# Altium project q23-harness.PrjPcb (part 1 of 2)
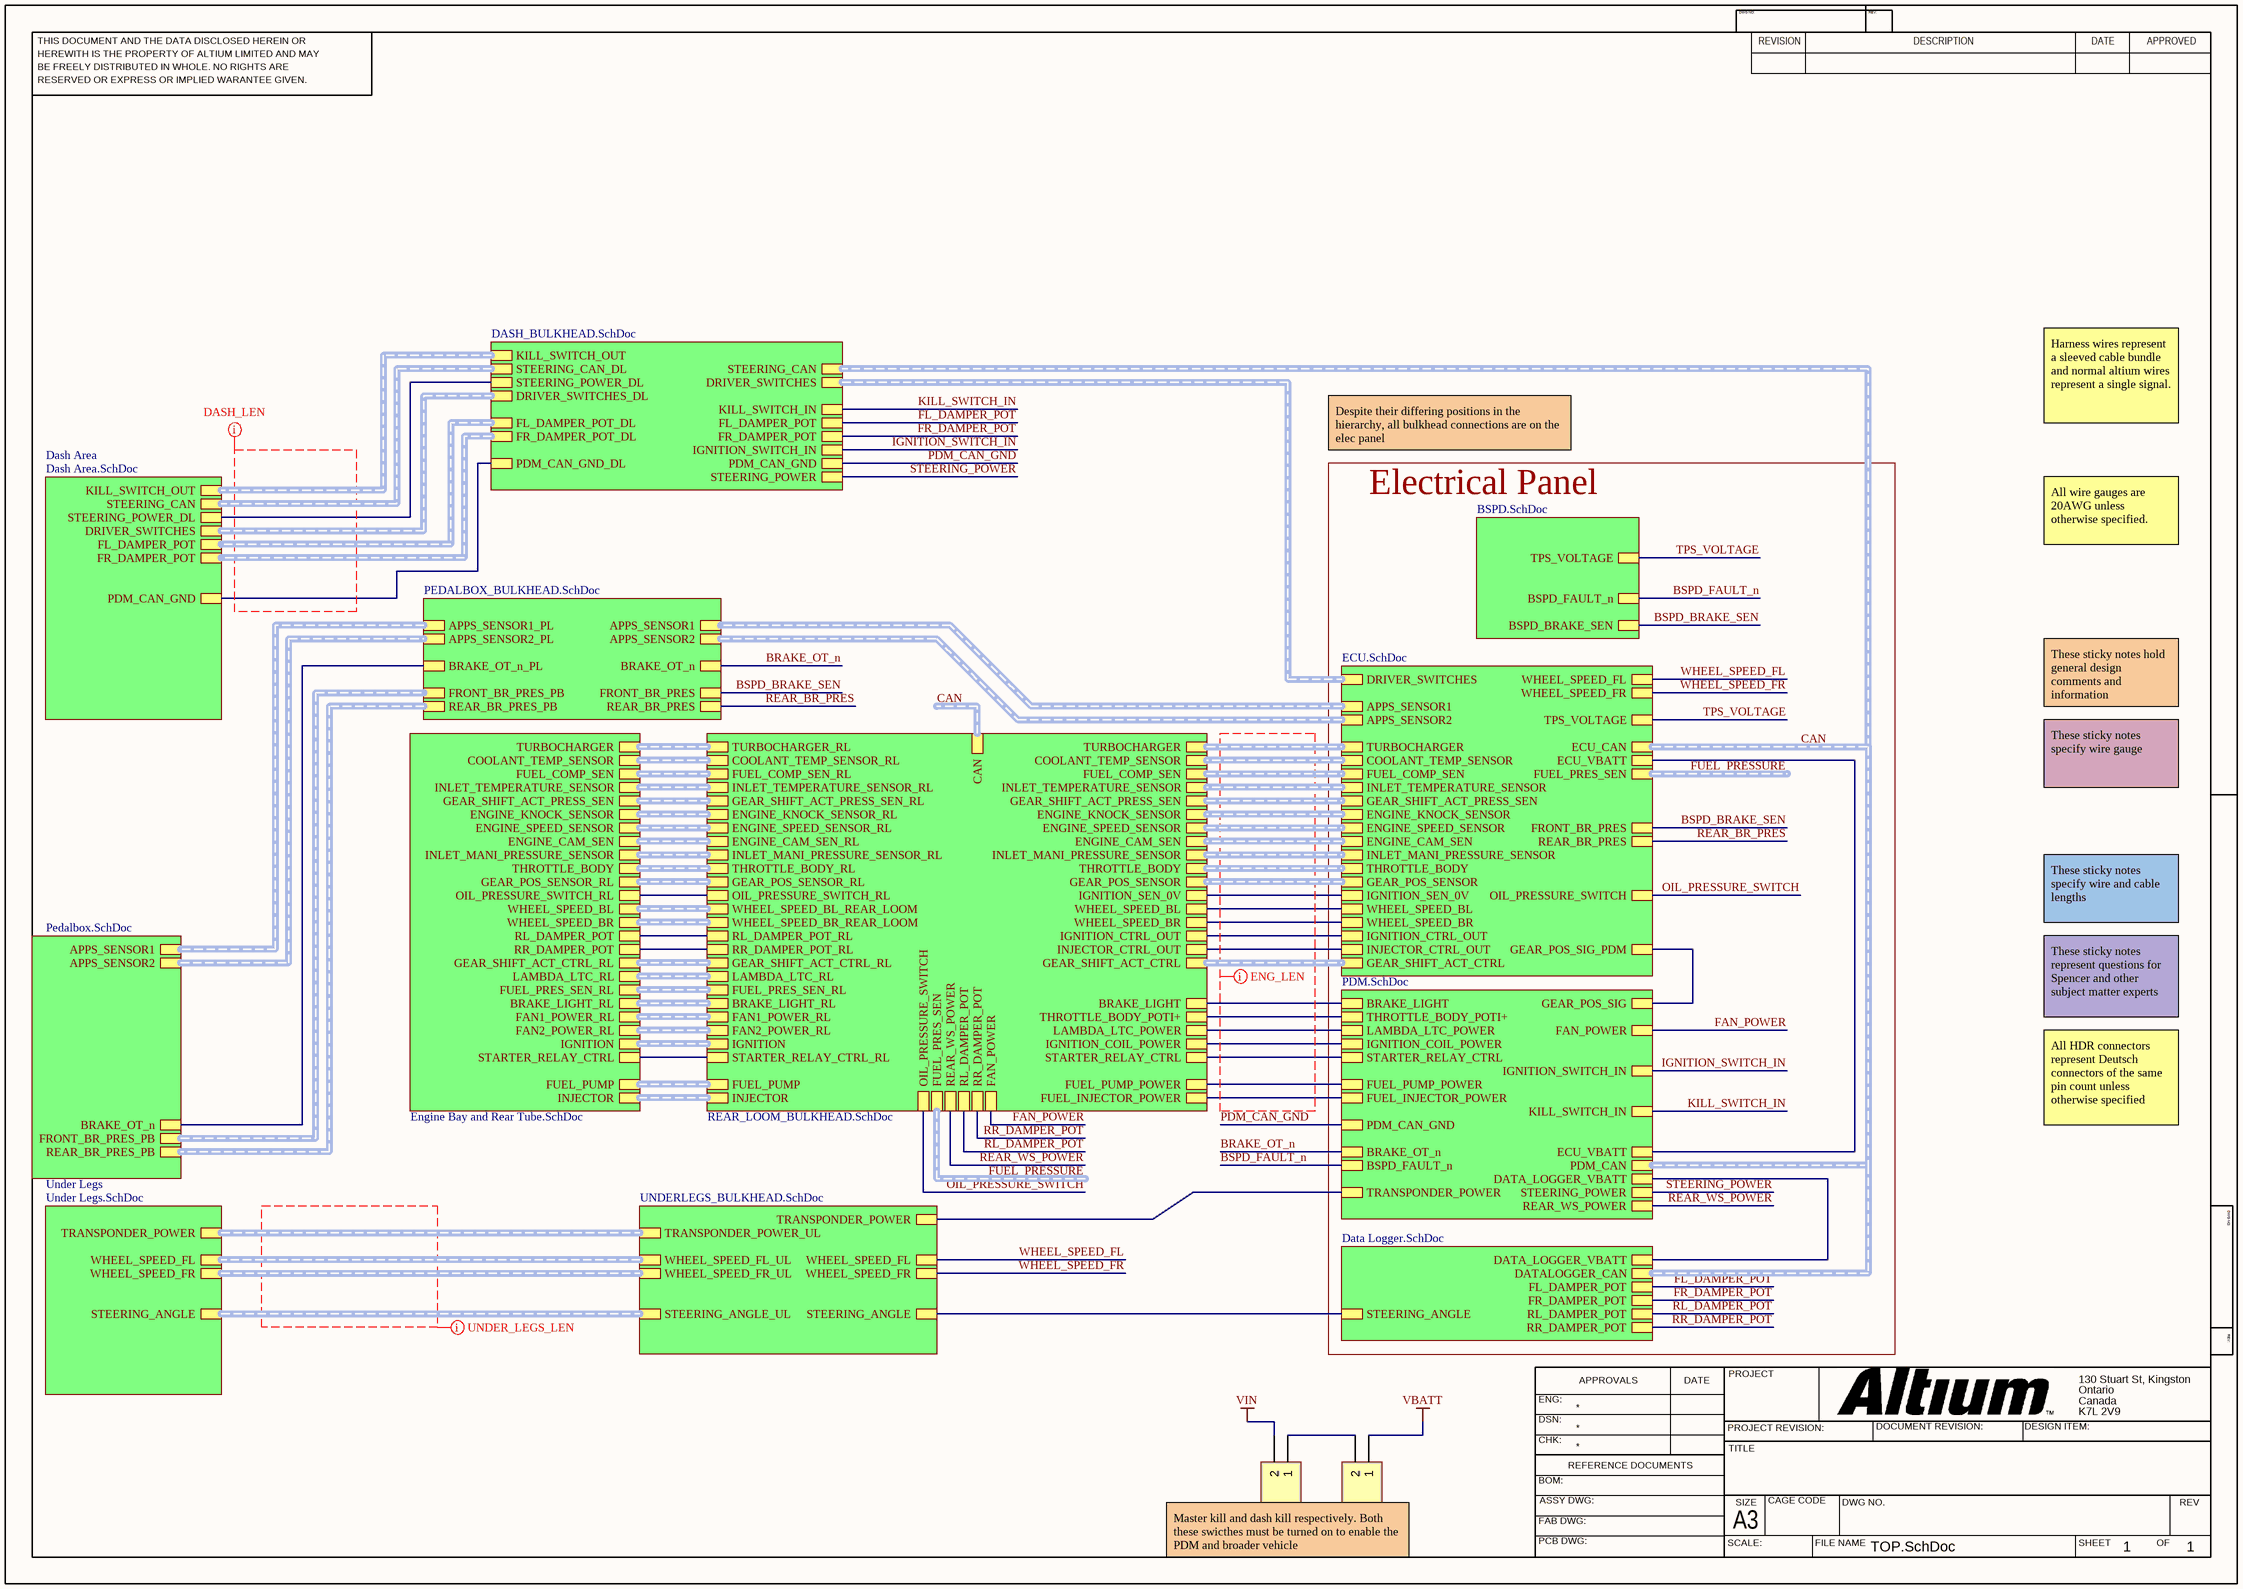
[diagram p0: TOP.SchDoc]
14 sheets, 69 parts. Net scope: hierarchical (ports join the sheet entries above them; power ports are global).
Sheets:
  TOP.SchDoc
    Dash Area = Dash Area.SchDoc
    Pedalbox = Pedalbox.SchDoc
    Under Legs = Under Legs.SchDoc
    ECU = ECU.SchDoc
    Engine Bay and Rear Tube = Engine Bay and Rear Tube.SchDoc
    PDM = PDM.SchDoc
    Data Logger = Data Logger.SchDoc
    Engine Bay and Rear Tube = REAR_LOOM_BULKHEAD.SchDoc
    PEDALBOX_BULKHEAD = PEDALBOX_BULKHEAD.SchDoc
    UNDERLEGS_BULKHEAD = UNDERLEGS_BULKHEAD.SchDoc
    DASH_BULKHEAD = DASH_BULKHEAD.SchDoc
    BSPD = BSPD.SchDoc
  LEGEND.SchDoc

## Sheet TOP.SchDoc: =DocumentName
size 420 x 297 mm; Organization: Queen's Formula SAE; Address1: 130 Stuart St, Kingston; Address2: Ontario; Address3: Canada; Address4: K7L 2V9; DocumentNumber: 1; Revision: 0; SheetNumber: 1; SheetTotal: 1

### Parts
(Parts that share a designator on the sheet are numbered #1, #2 ... from top to bottom, then left to right.)
ECU_CAN_CONNECTOR?#1  Header 2  [HDR1X2]  (value not drawn)
ECU_CAN_CONNECTOR?#2  Header 2  [HDR1X2]  (value not drawn)

### Sub-sheets
BSPD = BSPD.SchDoc: TPS_VOLTAGE, BSPD_BRAKE_SEN, BSPD_FAULT_n
Dash Area = Dash Area.SchDoc: STEERING_CAN (harness CAN), DRIVER_SWITCHES (harness DRIVER_SWITCHES), FL_DAMPER_POT, FR_DAMPER_POT, PDM_CAN_GND, STEERING_POWER_DL, KILL_SWITCH_OUT
DASH_BULKHEAD = DASH_BULKHEAD.SchDoc: DRIVER_SWITCHES (harness DRIVER_SWITCHES), STEERING_CAN (harness CAN), FL_DAMPER_POT, FR_DAMPER_POT, PDM_CAN_GND, DRIVER_SWITCHES_DL (harness DRIVER_SWITCHES), STEERING_CAN_DL (harness CAN), FL_DAMPER_POT_DL, FR_DAMPER_POT_DL, PDM_CAN_GND_DL, STEERING_POWER, STEERING_POWER_DL, KILL_SWITCH_IN, KILL_SWITCH_OUT, IGNITION_SWITCH_IN
Data Logger = Data Logger.SchDoc: DATALOGGER_CAN (harness CAN), DATA_LOGGER_VBATT, STEERING_ANGLE, RL_DAMPER_POT, RR_DAMPER_POT, FL_DAMPER_POT, FR_DAMPER_POT
ECU = ECU.SchDoc: ECU_CAN (harness CAN), ECU_VBATT, DRIVER_SWITCHES (harness DRIVER_SWITCHES), APPS_SENSOR1 (harness 3WIRE_PSG_SENSOR), COOLANT_TEMP_SENSOR (harness 2WIRE_SENSOR), INLET_TEMPERATURE_SENSOR (harness 2WIRE_SENSOR), FUEL_COMP_SEN (harness 2WIRE_SENSOR), GEAR_SHIFT_ACT_PRESS_SEN (harness 2WIRE_SENSOR), ENGINE_KNOCK_SENSOR (harness 2WIRE_ACTUATOR), ENGINE_SPEED_SENSOR (harness 2WIRE_ACTUATOR), WHEEL_SPEED_BL, WHEEL_SPEED_BR, WHEEL_SPEED_FL, WHEEL_SPEED_FR, ENGINE_CAM_SEN (harness 2WIRE_ACTUATOR), INLET_MANI_PRESSURE_SENSOR (harness 2WIRE_ACTUATOR), THROTTLE_BODY (harness 2WIRE_ACTUATOR), GEAR_SHIFT_ACT_CTRL (harness GEAR_SHIFT_ACTUATOR), TURBOCHARGER (harness TURBO), APPS_SENSOR2 (harness 3WIRE_PSG_SENSOR), IGNITION_CTRL_OUT, INJECTOR_CTRL_OUT, TPS_VOLTAGE, GEAR_POS_SENSOR (harness 2WIRE_ACTUATOR), IGNITION_SEN_0V, FUEL_PRES_SEN (harness 3WIRE_PSG_SENSOR), OIL_PRESSURE_SWITCH, FRONT_BR_PRES, REAR_BR_PRES, GEAR_POS_SIG_PDM
Engine Bay and Rear Tube = Engine Bay and Rear Tube.SchDoc: COOLANT_TEMP_SENSOR (harness 2WIRE_SENSOR), INLET_TEMPERATURE_SENSOR (harness 2WIRE_SENSOR), FUEL_COMP_SEN (harness 3WIRE_PSG_SENSOR), GEAR_SHIFT_ACT_PRESS_SEN (harness 3WIRE_PSG_SENSOR), ENGINE_KNOCK_SENSOR (harness 2WIRE_ACTUATOR), ENGINE_SPEED_SENSOR, ENGINE_CAM_SEN, INLET_MANI_PRESSURE_SENSOR, THROTTLE_BODY, WHEEL_SPEED_BL, WHEEL_SPEED_BR, GEAR_SHIFT_ACT_CTRL_RL, BRAKE_LIGHT_RL, IGNITION, STARTER_RELAY_CTRL, FUEL_PUMP, INJECTOR, TURBOCHARGER, RL_DAMPER_POT, RR_DAMPER_POT, GEAR_POS_SENSOR_RL, FAN1_POWER_RL, FAN2_POWER_RL, FUEL_PRES_SEN_RL, LAMBDA_LTC_RL, OIL_PRESSURE_SWITCH_RL
Engine Bay and Rear Tube = REAR_LOOM_BULKHEAD.SchDoc: BRAKE_LIGHT, WHEEL_SPEED_BL, WHEEL_SPEED_BR, THROTTLE_BODY_POTI+, IGNITION_COIL_POWER, STARTER_RELAY_CTRL, FUEL_PUMP_POWER, FUEL_INJECTOR_POWER, GEAR_SHIFT_ACT_CTRL, COOLANT_TEMP_SENSOR_RL (harness 2WIRE_SENSOR), INLET_TEMPERATURE_SENSOR_RL (harness 2WIRE_SENSOR), FUEL_COMP_SEN_RL (harness 3WIRE_PSG_SENSOR), GEAR_SHIFT_ACT_PRESS_SEN_RL (harness 3WIRE_PSG_SENSOR), ENGINE_KNOCK_SENSOR_RL (harness 2WIRE_ACTUATOR), ENGINE_SPEED_SENSOR_RL, ENGINE_CAM_SEN_RL, INLET_MANI_PRESSURE_SENSOR_RL, THROTTLE_BODY_RL, TURBOCHARGER_RL, COOLANT_TEMP_SENSOR (harness 2WIRE_SENSOR), INLET_TEMPERATURE_SENSOR (harness 2WIRE_SENSOR), FUEL_COMP_SEN (harness 3WIRE_PSG_SENSOR), GEAR_SHIFT_ACT_PRESS_SEN (harness 3WIRE_PSG_SENSOR), ENGINE_KNOCK_SENSOR (harness 2WIRE_ACTUATOR), ENGINE_SPEED_SENSOR, ENGINE_CAM_SEN, INLET_MANI_PRESSURE_SENSOR, THROTTLE_BODY, TURBOCHARGER, WHEEL_SPEED_BL_REAR_LOOM, WHEEL_SPEED_BR_REAR_LOOM, GEAR_SHIFT_ACT_CTRL_RL, BRAKE_LIGHT_RL, IGNITION_CTRL_OUT, INJECTOR_CTRL_OUT, IGNITION, INJECTOR, FUEL_PUMP, STARTER_RELAY_CTRL_RL, GEAR_POS_SENSOR, RL_DAMPER_POT_RL, RR_DAMPER_POT_RL, GEAR_POS_SENSOR_RL, RL_DAMPER_POT, RR_DAMPER_POT, REAR_WS_POWER, IGNITION_SEN_0V, FAN_POWER, FAN2_POWER_RL, FAN1_POWER_RL, FUEL_PRES_SEN_RL, FUEL_PRES_SEN, CAN, LAMBDA_LTC_POWER, LAMBDA_LTC_RL, OIL_PRESSURE_SWITCH, OIL_PRESSURE_SWITCH_RL
PDM = PDM.SchDoc: TRANSPONDER_POWER, BRAKE_LIGHT, BRAKE_OT_n, BSPD_FAULT_n, PDM_CAN_GND, PDM_CAN (harness CAN), DATA_LOGGER_VBATT, ECU_VBATT, KILL_SWITCH_IN, THROTTLE_BODY_POTI+, IGNITION_COIL_POWER, STARTER_RELAY_CTRL, FUEL_PUMP_POWER, FUEL_INJECTOR_POWER, FAN_POWER, STEERING_POWER, REAR_WS_POWER, LAMBDA_LTC_POWER, IGNITION_SWITCH_IN, GEAR_POS_SIG
Pedalbox = Pedalbox.SchDoc: APPS_SENSOR1 (harness 3WIRE_PSG_SENSOR), BRAKE_OT_n, APPS_SENSOR2, FRONT_BR_PRES_PB, REAR_BR_PRES_PB
PEDALBOX_BULKHEAD = PEDALBOX_BULKHEAD.SchDoc: APPS_SENSOR1 (harness 3WIRE_PSG_SENSOR), APPS_SENSOR2, BRAKE_OT_n, APPS_SENSOR1_PL (harness 3WIRE_PSG_SENSOR), APPS_SENSOR2_PL, BRAKE_OT_n_PL, REAR_BR_PRES, FRONT_BR_PRES, REAR_BR_PRES_PB, FRONT_BR_PRES_PB
Under Legs = Under Legs.SchDoc: STEERING_ANGLE, WHEEL_SPEED_FL, WHEEL_SPEED_FR, TRANSPONDER_POWER
UNDERLEGS_BULKHEAD = UNDERLEGS_BULKHEAD.SchDoc: STEERING_ANGLE, STEERING_ANGLE_UL, WHEEL_SPEED_FL, WHEEL_SPEED_FR, WHEEL_SPEED_FL_UL, WHEEL_SPEED_FR_UL, TRANSPONDER_POWER_UL, TRANSPONDER_POWER

### Nets
PDM_CAN_GND: sheet Dash Area/PDM_CAN_GND, sheet PDM/PDM_CAN_GND, sheet DASH_BULKHEAD/PDM_CAN_GND, sheet DASH_BULKHEAD/PDM_CAN_GND_DL  [project net FUEL_PRESSURE.SEN_0V]
VBATT: ECU_CAN_CONNECTOR?#2.1
VIN: ECU_CAN_CONNECTOR?#1.2
BRAKE_LIGHT: sheet PDM/BRAKE_LIGHT, sheet Engine Bay and Rear Tube/BRAKE_LIGHT
BRAKE_OT_n: sheet Pedalbox/BRAKE_OT_n, sheet PDM/BRAKE_OT_n, sheet PEDALBOX_BULKHEAD/BRAKE_OT_n, sheet PEDALBOX_BULKHEAD/BRAKE_OT_n_PL
BSPD_BRAKE_SEN: sheet ECU/FRONT_BR_PRES, sheet PEDALBOX_BULKHEAD/FRONT_BR_PRES, sheet BSPD/BSPD_BRAKE_SEN
BSPD_FAULT_n: sheet PDM/BSPD_FAULT_n, sheet BSPD/BSPD_FAULT_n
DATA_LOGGER_VBATT: sheet PDM/DATA_LOGGER_VBATT, sheet Data Logger/DATA_LOGGER_VBATT
ECU_VBATT: sheet ECU/ECU_VBATT, sheet PDM/ECU_VBATT
FAN_POWER: sheet PDM/FAN_POWER, sheet Engine Bay and Rear Tube/FAN_POWER  [project net COOLING_FAN_POWER]
FL_DAMPER_POT: sheet Data Logger/FL_DAMPER_POT, sheet DASH_BULKHEAD/FL_DAMPER_POT
FR_DAMPER_POT: sheet Data Logger/FR_DAMPER_POT, sheet DASH_BULKHEAD/FR_DAMPER_POT
FUEL_INJECTOR_POWER: sheet PDM/FUEL_INJECTOR_POWER, sheet Engine Bay and Rear Tube/FUEL_INJECTOR_POWER
FUEL_PUMP_POWER: sheet PDM/FUEL_PUMP_POWER, sheet Engine Bay and Rear Tube/FUEL_PUMP_POWER
GEAR_POS_SIG: sheet ECU/GEAR_POS_SIG_PDM, sheet PDM/GEAR_POS_SIG
IGNITION_COIL_POWER: sheet PDM/IGNITION_COIL_POWER, sheet Engine Bay and Rear Tube/IGNITION_COIL_POWER
IGNITION_CTRL_OUT: sheet ECU/IGNITION_CTRL_OUT, sheet Engine Bay and Rear Tube/IGNITION_CTRL_OUT
IGNITION_SEN_0V: sheet ECU/IGNITION_SEN_0V, sheet Engine Bay and Rear Tube/IGNITION_SEN_0V
IGNITION_SWITCH_IN: sheet PDM/IGNITION_SWITCH_IN, sheet DASH_BULKHEAD/IGNITION_SWITCH_IN
INJECTOR_CTRL_OUT: sheet ECU/INJECTOR_CTRL_OUT, sheet Engine Bay and Rear Tube/INJECTOR_CTRL_OUT
KILL_SWITCH_IN: sheet PDM/KILL_SWITCH_IN, sheet DASH_BULKHEAD/KILL_SWITCH_IN
LAMBDA_LTC_POWER: sheet PDM/LAMBDA_LTC_POWER, sheet Engine Bay and Rear Tube/LAMBDA_LTC_POWER
OIL_PRESSURE_SWITCH: sheet ECU/OIL_PRESSURE_SWITCH, sheet Engine Bay and Rear Tube/OIL_PRESSURE_SWITCH_RL, sheet Engine Bay and Rear Tube/OIL_PRESSURE_SWITCH, sheet Engine Bay and Rear Tube/OIL_PRESSURE_SWITCH_RL
REAR_BR_PRES: sheet ECU/REAR_BR_PRES, sheet PEDALBOX_BULKHEAD/REAR_BR_PRES
REAR_WS_POWER: sheet PDM/REAR_WS_POWER, sheet Engine Bay and Rear Tube/REAR_WS_POWER
RL_DAMPER_POT: sheet Data Logger/RL_DAMPER_POT, sheet Engine Bay and Rear Tube/RL_DAMPER_POT
RR_DAMPER_POT: sheet Data Logger/RR_DAMPER_POT, sheet Engine Bay and Rear Tube/RR_DAMPER_POT
STARTER_RELAY_CTRL: sheet Engine Bay and Rear Tube/STARTER_RELAY_CTRL, sheet PDM/STARTER_RELAY_CTRL, sheet Engine Bay and Rear Tube/STARTER_RELAY_CTRL, sheet Engine Bay and Rear Tube/STARTER_RELAY_CTRL_RL
STEERING_ANGLE: sheet Data Logger/STEERING_ANGLE, sheet UNDERLEGS_BULKHEAD/STEERING_ANGLE
STEERING_POWER: sheet Dash Area/STEERING_POWER_DL, sheet PDM/STEERING_POWER, sheet DASH_BULKHEAD/STEERING_POWER, sheet DASH_BULKHEAD/STEERING_POWER_DL
THROTTLE_BODY_POTI+: sheet PDM/THROTTLE_BODY_POTI+, sheet Engine Bay and Rear Tube/THROTTLE_BODY_POTI+
TPS_VOLTAGE: sheet ECU/TPS_VOLTAGE, sheet BSPD/TPS_VOLTAGE
TRANSPONDER_POWER: sheet PDM/TRANSPONDER_POWER, sheet UNDERLEGS_BULKHEAD/TRANSPONDER_POWER
WHEEL_SPEED_BL: sheet ECU/WHEEL_SPEED_BL, sheet Engine Bay and Rear Tube/WHEEL_SPEED_BL
WHEEL_SPEED_BR: sheet ECU/WHEEL_SPEED_BR, sheet Engine Bay and Rear Tube/WHEEL_SPEED_BR
WHEEL_SPEED_FL: sheet ECU/WHEEL_SPEED_FL, sheet UNDERLEGS_BULKHEAD/WHEEL_SPEED_FL
WHEEL_SPEED_FR: sheet ECU/WHEEL_SPEED_FR, sheet UNDERLEGS_BULKHEAD/WHEEL_SPEED_FR
NetECU_CAN_CONNECTOR?#1_1: ECU_CAN_CONNECTOR?#1.1 ECU_CAN_CONNECTOR?#2.2
(unnamed): sheet Engine Bay and Rear Tube/RL_DAMPER_POT, sheet Engine Bay and Rear Tube/RL_DAMPER_POT_RL
(unnamed): sheet Engine Bay and Rear Tube/RR_DAMPER_POT, sheet Engine Bay and Rear Tube/RR_DAMPER_POT_RL

### Buses and harness runs
harness CAN = sheet DASH_BULKHEAD/STEERING_CAN = sheet Data Logger/DATALOGGER_CAN = sheet ECU/ECU_CAN = sheet PDM/PDM_CAN
harness CAN = sheet Engine Bay and Rear Tube/CAN
harness FUEL_PRESSURE = sheet ECU/FUEL_PRES_SEN
harness FUEL_PRESSURE = sheet Engine Bay and Rear Tube/FUEL_PRES_SEN
harness sheet Dash Area/DRIVER_SWITCHES = sheet DASH_BULKHEAD/DRIVER_SWITCHES_DL
harness sheet Dash Area/FL_DAMPER_POT = sheet DASH_BULKHEAD/FL_DAMPER_POT_DL
harness sheet Dash Area/FR_DAMPER_POT = sheet DASH_BULKHEAD/FR_DAMPER_POT_DL
harness sheet Dash Area/KILL_SWITCH_OUT = sheet DASH_BULKHEAD/KILL_SWITCH_OUT
harness sheet Dash Area/STEERING_CAN = sheet DASH_BULKHEAD/STEERING_CAN_DL
harness sheet DASH_BULKHEAD/DRIVER_SWITCHES = sheet ECU/DRIVER_SWITCHES
harness sheet ECU/APPS_SENSOR1 = sheet PEDALBOX_BULKHEAD/APPS_SENSOR1
harness sheet ECU/APPS_SENSOR2 = sheet PEDALBOX_BULKHEAD/APPS_SENSOR2
harness sheet ECU/COOLANT_TEMP_SENSOR = sheet Engine Bay and Rear Tube/COOLANT_TEMP_SENSOR
harness sheet ECU/ENGINE_CAM_SEN = sheet Engine Bay and Rear Tube/ENGINE_CAM_SEN
harness sheet ECU/ENGINE_KNOCK_SENSOR = sheet Engine Bay and Rear Tube/ENGINE_KNOCK_SENSOR
harness sheet ECU/ENGINE_SPEED_SENSOR = sheet Engine Bay and Rear Tube/ENGINE_SPEED_SENSOR
harness sheet ECU/FUEL_COMP_SEN = sheet Engine Bay and Rear Tube/FUEL_COMP_SEN
harness sheet ECU/GEAR_POS_SENSOR = sheet Engine Bay and Rear Tube/GEAR_POS_SENSOR
harness sheet ECU/GEAR_SHIFT_ACT_CTRL = sheet Engine Bay and Rear Tube/GEAR_SHIFT_ACT_CTRL
harness sheet ECU/GEAR_SHIFT_ACT_PRESS_SEN = sheet Engine Bay and Rear Tube/GEAR_SHIFT_ACT_PRESS_SEN
harness sheet ECU/INLET_MANI_PRESSURE_SENSOR = sheet Engine Bay and Rear Tube/INLET_MANI_PRESSURE_SENSOR
harness sheet ECU/INLET_TEMPERATURE_SENSOR = sheet Engine Bay and Rear Tube/INLET_TEMPERATURE_SENSOR
harness sheet ECU/THROTTLE_BODY = sheet Engine Bay and Rear Tube/THROTTLE_BODY
harness sheet ECU/TURBOCHARGER = sheet Engine Bay and Rear Tube/TURBOCHARGER
harness sheet Engine Bay and Rear Tube/COOLANT_TEMP_SENSOR = sheet Engine Bay and Rear Tube/COOLANT_TEMP_SENSOR_RL
harness sheet Engine Bay and Rear Tube/ENGINE_CAM_SEN = sheet Engine Bay and Rear Tube/ENGINE_CAM_SEN_RL
harness sheet Engine Bay and Rear Tube/ENGINE_KNOCK_SENSOR = sheet Engine Bay and Rear Tube/ENGINE_KNOCK_SENSOR_RL
harness sheet Engine Bay and Rear Tube/ENGINE_SPEED_SENSOR = sheet Engine Bay and Rear Tube/ENGINE_SPEED_SENSOR_RL
harness sheet Engine Bay and Rear Tube/FUEL_COMP_SEN = sheet Engine Bay and Rear Tube/FUEL_COMP_SEN_RL
harness sheet Engine Bay and Rear Tube/GEAR_SHIFT_ACT_PRESS_SEN = sheet Engine Bay and Rear Tube/GEAR_SHIFT_ACT_PRESS_SEN_RL
harness sheet Engine Bay and Rear Tube/INLET_MANI_PRESSURE_SENSOR = sheet Engine Bay and Rear Tube/INLET_MANI_PRESSURE_SENSOR_RL
harness sheet Engine Bay and Rear Tube/INLET_TEMPERATURE_SENSOR = sheet Engine Bay and Rear Tube/INLET_TEMPERATURE_SENSOR_RL
harness sheet Engine Bay and Rear Tube/THROTTLE_BODY = sheet Engine Bay and Rear Tube/THROTTLE_BODY_RL
harness sheet Engine Bay and Rear Tube/TURBOCHARGER = sheet Engine Bay and Rear Tube/TURBOCHARGER_RL
harness sheet Engine Bay and Rear Tube/WHEEL_SPEED_BL = sheet Engine Bay and Rear Tube/WHEEL_SPEED_BL_REAR_LOOM
harness sheet Engine Bay and Rear Tube/WHEEL_SPEED_BR = sheet Engine Bay and Rear Tube/WHEEL_SPEED_BR_REAR_LOOM
harness sheet Pedalbox/APPS_SENSOR1 = sheet PEDALBOX_BULKHEAD/APPS_SENSOR1_PL
harness sheet Pedalbox/APPS_SENSOR2 = sheet PEDALBOX_BULKHEAD/APPS_SENSOR2_PL
harness sheet Pedalbox/FRONT_BR_PRES_PB = sheet PEDALBOX_BULKHEAD/FRONT_BR_PRES_PB
harness sheet Pedalbox/REAR_BR_PRES_PB = sheet PEDALBOX_BULKHEAD/REAR_BR_PRES_PB
harness sheet Under Legs/STEERING_ANGLE = sheet UNDERLEGS_BULKHEAD/STEERING_ANGLE_UL
harness sheet Under Legs/TRANSPONDER_POWER = sheet UNDERLEGS_BULKHEAD/TRANSPONDER_POWER_UL
harness sheet Under Legs/WHEEL_SPEED_FL = sheet UNDERLEGS_BULKHEAD/WHEEL_SPEED_FL_UL
harness sheet Under Legs/WHEEL_SPEED_FR = sheet UNDERLEGS_BULKHEAD/WHEEL_SPEED_FR_UL

### Layout directives
mark named UNDER_LEGS_LEN: (no net found under the mark)
mark named ENG_LEN: (no net found under the mark)
mark named DASH_LEN: (no net found under the mark)

### Notes on the sheet
- Despite their differing positions in the hierarchy, all bulkhead connections are on the elec panel
- Harness wires represent a sleeved cable bundle and normal altium wires represent a single signal.
- Electrical Panel
- All wire gauges are 20AWG unless otherwise specified.
- These sticky notes hold general design comments and information
- These sticky notes specify wire gauge
- These sticky notes specify wire and cable lengths
- These sticky notes represent questions for Spencer and other subject matter experts
- All HDR connectors represent Deutsch connectors of the same pin count unless otherwise specified
- (near ECU_CAN_CONNECTOR?#1) Master kill and dash kill respectively. Both these swicthes must be turned on to enable the PDM and broader vehicle
- THIS DOCUMENT AND THE DATA DISCLOSED HEREIN OR
- HEREWITH IS THE PROPERTY OF ALTIUM LIMITED AND MAY
- DWG NO:
- REVISION
- REV:
- DESCRIPTION
- DATE
- APPROVED
- BE FREELY DISTRIBUTED IN WHOLE. NO RIGHTS ARE
- RESERVED OR EXPRESS OR IMPLIED WARANTEE GIVEN.
- ENG:
- APPROVALS
- PROJECT
- DSN:
- CHK:
- REFERENCE DOCUMENTS
- PROJECT REVISION:
- TITLE
- DOCUMENT REVISION:
- DESIGN ITEM:
- BOM:
- FAB DWG:
- PCB DWG:
- ASSY DWG:
- SCALE:
- A3
- SIZE
- CAGE CODE
- FILE NAME
- DWG NO.
- SHEET
- OF
- REV

### Library data of the parts
ECU_CAN_CONNECTOR?#1 ECU_CAN_CONNECTOR?#2 = Header 2: Header, 2-Pin; LatestRevisionDate: 17-Jul-2002; LatestRevisionNote: Re-released for DXP Platform.; Publisher: Altium Limited

## Sheet Dash Area.SchDoc: =DocumentName
size A4; Organization: Queen's Formula SAE; Address1: 130 Stuart St, Kingston; Address2: Ontario; Address3: Canada; Address4: K7L 2V9; DocumentNumber: 1; Revision: 0; SheetNumber: 1; SheetTotal: 1
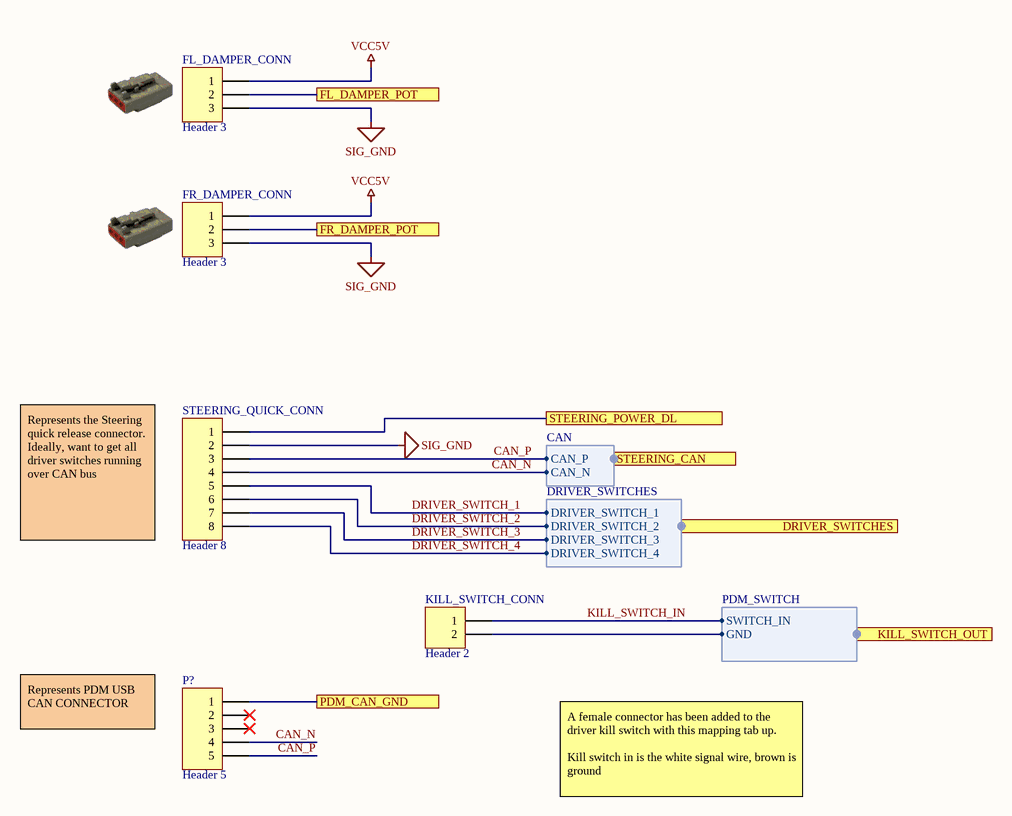
[diagram p1: Dash Area.SchDoc]

### Parts
FL_DAMPER_CONN  Header 3  [HDR1X3]
FR_DAMPER_CONN  Header 3  [HDR1X3]
KILL_SWITCH_CONN  Header 2  [HDR1X2]
P?  Header 5  [HDR1X5]
STEERING_QUICK_CONN  Header 8  [HDR1X8]

### Ports
DRIVER_SWITCHES (harness DRIVER_SWITCHES), FL_DAMPER_POT, FR_DAMPER_POT, KILL_SWITCH_OUT (harness PDM_SWITCH), PDM_CAN_GND, STEERING_CAN (harness CAN), STEERING_POWER_DL

### Harnesses
CAN: CAN_P, CAN_N
DRIVER_SWITCHES: DRIVER_SWITCH_1, DRIVER_SWITCH_2, DRIVER_SWITCH_3, DRIVER_SWITCH_4
PDM_SWITCH: SWITCH_IN, GND

### Nets
SIG_GND: FL_DAMPER_CONN.3 FR_DAMPER_CONN.3 KILL_SWITCH_CONN.2 P?.1 STEERING_QUICK_CONN.2 ; port PDM_CAN_GND, port KILL_SWITCH_OUT.GND  [project net FUEL_PRESSURE.SEN_0V]
VCC5V: FL_DAMPER_CONN.1 FR_DAMPER_CONN.1  [project net FUEL_PRESSURE.SEN_5V]
CAN_N: P?.4 STEERING_QUICK_CONN.4 ; port STEERING_CAN.CAN_N  [project net CAN.CAN_N]
CAN_P: P?.5 STEERING_QUICK_CONN.3 ; port STEERING_CAN.CAN_P  [project net CAN.CAN_P]
DRIVER_SWITCH_1: STEERING_QUICK_CONN.5 ; port DRIVER_SWITCHES.DRIVER_SWITCH_1
DRIVER_SWITCH_2: STEERING_QUICK_CONN.6 ; port DRIVER_SWITCHES.DRIVER_SWITCH_2
DRIVER_SWITCH_3: STEERING_QUICK_CONN.7 ; port DRIVER_SWITCHES.DRIVER_SWITCH_3
DRIVER_SWITCH_4: STEERING_QUICK_CONN.8 ; port DRIVER_SWITCHES.DRIVER_SWITCH_4
KILL_SWITCH_IN: KILL_SWITCH_CONN.1 ; port KILL_SWITCH_OUT.SWITCH_IN
STEERING_POWER: STEERING_QUICK_CONN.1 ; port STEERING_POWER_DL
NetFL_DAMPER_CONN_2: FL_DAMPER_CONN.2 ; port FL_DAMPER_POT
NetFR_DAMPER_CONN_2: FR_DAMPER_CONN.2 ; port FR_DAMPER_POT

Not connected (* = marked no-connect by the designer): P? 2* 3*

### Notes on the sheet
- Represents the Steering quick release connector. Ideally, want to get all driver switches running over CAN bus
- Represents PDM USB CAN CONNECTOR
- A female connector has been added to the driver kill switch with this mapping tab up.
  Kill switch in is the white signal wire, brown is ground
- Title
- Size:
- Date:
- A4
- Number:
- Time:
- Revision:
- Sheet
- of
- File:

### Library data of the parts
FL_DAMPER_CONN FR_DAMPER_CONN = Header 3: Header, 3-Pin; LatestRevisionDate: 17-Jul-2002; LatestRevisionNote: Re-released for DXP Platform.; Publisher: Altium Limited
KILL_SWITCH_CONN = Header 2: Header, 2-Pin; LatestRevisionDate: 17-Jul-2002; LatestRevisionNote: Re-released for DXP Platform.; Publisher: Altium Limited
P? = Header 5: Header, 5-Pin; LatestRevisionDate: 17-Jul-2002; LatestRevisionNote: Re-released for DXP Platform.; Publisher: Altium Limited
STEERING_QUICK_CONN = Header 8: Header, 8-Pin; LatestRevisionDate: 17-Jul-2002; LatestRevisionNote: Re-released for DXP Platform.; Publisher: Altium Limited

## Sheet Pedalbox.SchDoc: =DocumentName
size A4; Organization: Queen's Formula SAE; Address1: 130 Stuart St, Kingston; Address2: Ontario; Address3: Canada; Address4: K7L 2V9; DocumentNumber: 1; Revision: 0; SheetNumber: 1; SheetTotal: 1
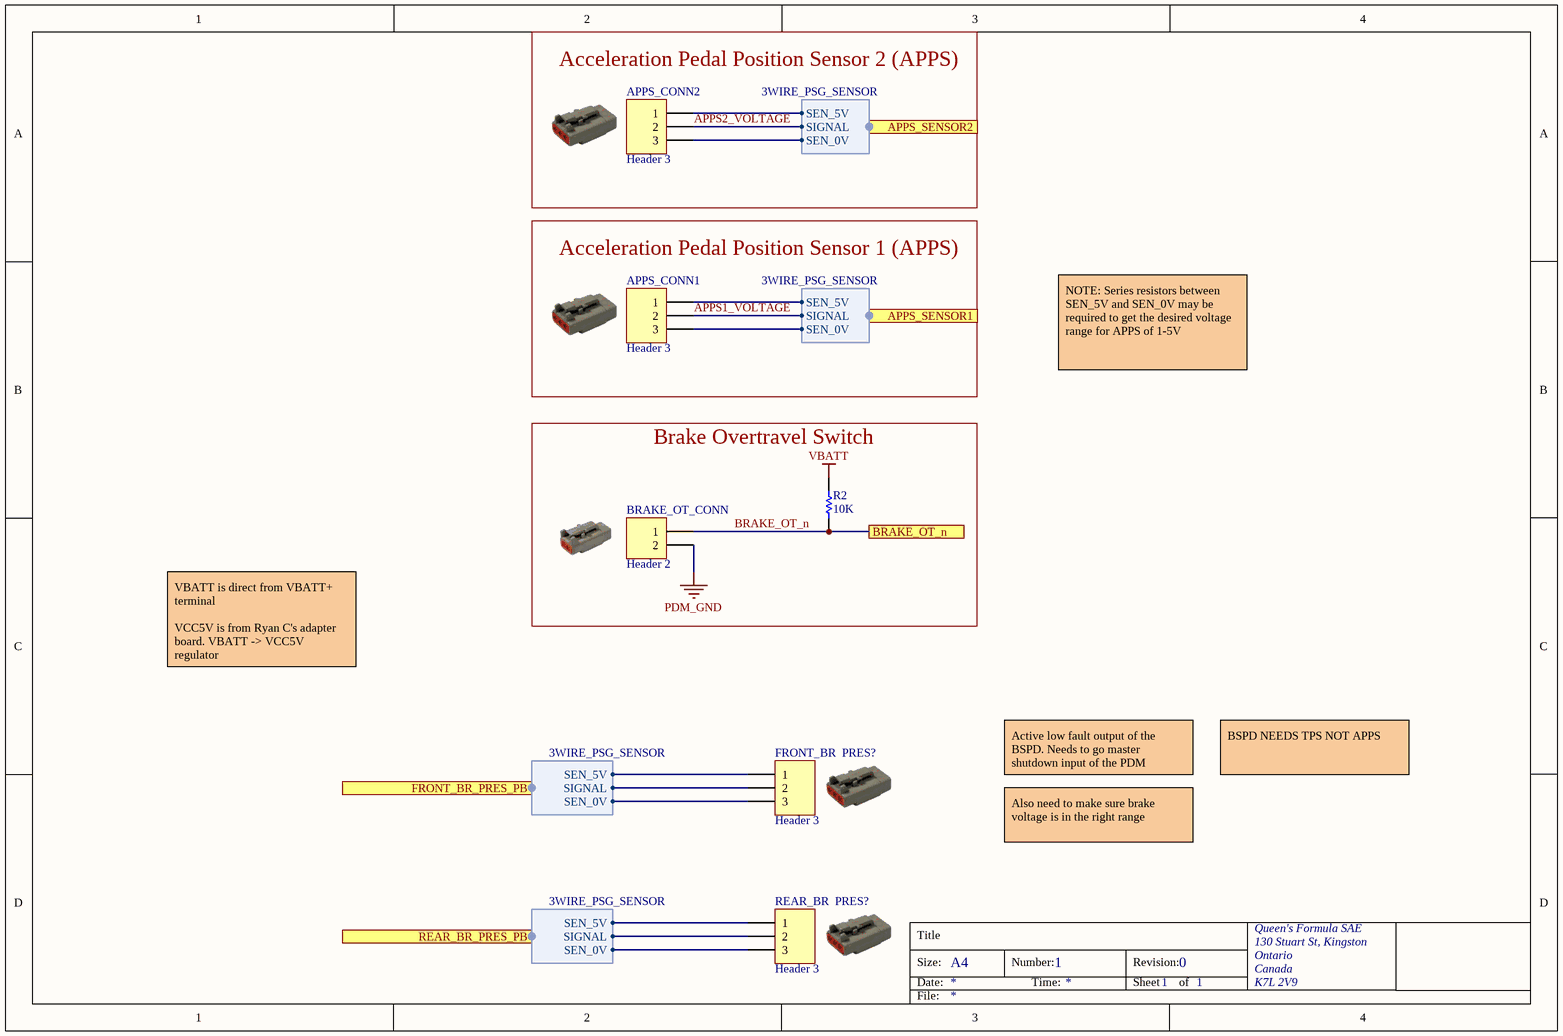
[diagram p2: Pedalbox.SchDoc]

### Parts
APPS_CONN1  Header 3  [HDR1X3]
APPS_CONN2  Header 3  [HDR1X3]
BRAKE_OT_CONN  Header 2  [HDR1X2]
FRONT_BR_PRES?  Header 3  [HDR1X3]
R2  10K  [RESC3216X180X46ML20T20]
REAR_BR_PRES?  Header 3  [HDR1X3]

### Blocks framed on the sheet
Acceleration Pedal Position Sensor 2 (APPS): APPS_CONN2
Acceleration Pedal Position Sensor 1 (APPS): APPS_CONN1
Brake Overtravel Switch: BRAKE_OT_CONN R2

### Ports
APPS_SENSOR1 (harness 3WIRE_PSG_SENSOR), APPS_SENSOR2 (harness 3WIRE_PSG_SENSOR), BRAKE_OT_n, FRONT_BR_PRES_PB (harness 3WIRE_PSG_SENSOR), REAR_BR_PRES_PB (harness 3WIRE_PSG_SENSOR)

### Harnesses
3WIRE_PSG_SENSOR: SEN_5V, SEN_0V, SIGNAL

### Nets
FUEL_PRESSURE.SEN_5V: APPS_CONN2.1 FRONT_BR_PRES?.1 REAR_BR_PRES?.1 ; port APPS_SENSOR2.SEN_5V, port FRONT_BR_PRES_PB.SEN_5V, port REAR_BR_PRES_PB.SEN_5V
PDM_GND: APPS_CONN2.3 BRAKE_OT_CONN.2 FRONT_BR_PRES?.3 REAR_BR_PRES?.3 ; port APPS_SENSOR2.SEN_0V, port FRONT_BR_PRES_PB.SEN_0V, port REAR_BR_PRES_PB.SEN_0V  [project net FUEL_PRESSURE.SEN_0V]
VBATT: R2.2
APPS1_VOLTAGE: APPS_CONN1.2 ; port APPS_SENSOR1.SIGNAL
APPS2_VOLTAGE: APPS_CONN2.2 ; port APPS_SENSOR2.SIGNAL
BRAKE_OT_n: BRAKE_OT_CONN.1 R2.1 ; port BRAKE_OT_n
BSPD_BRAKE_SEN: FRONT_BR_PRES?.2 ; port FRONT_BR_PRES_PB.SIGNAL
REAR_BR_PRES: REAR_BR_PRES?.2 ; port REAR_BR_PRES_PB.SIGNAL
SEN_0V_A1: APPS_CONN1.3 ; port APPS_SENSOR1.SEN_0V
SEN_5V_A2: APPS_CONN1.1 ; port APPS_SENSOR1.SEN_5V

### Notes on the sheet
- NOTE: Series resistors between SEN_5V and SEN_0V may be required to get the desired voltage range for APPS of 1-5V
- VBATT is direct from VBATT+ terminal
  VCC5V is from Ryan C's adapter board. VBATT -> VCC5V regulator
- Active low fault output of the BSPD. Needs to go master shutdown input of the PDM
- BSPD NEEDS TPS NOT APPS
- Also need to make sure brake voltage is in the right range
- Title
- Size:
- Date:
- A4
- Number:
- Time:
- Revision:
- Sheet
- of
- File:

### Library data of the parts
APPS_CONN1 APPS_CONN2 FRONT_BR_PRES? REAR_BR_PRES? = Header 3: Header, 3-Pin; LatestRevisionDate: 17-Jul-2002; LatestRevisionNote: Re-released for DXP Platform.; Publisher: Altium Limited
BRAKE_OT_CONN = Header 2: Header, 2-Pin; LatestRevisionDate: 17-Jul-2002; LatestRevisionNote: Re-released for DXP Platform.; Publisher: Altium Limited
R2 = CMP-2003-04855-1: Part Number: NTHS1206N02N1002KE; Manufacturer: Vishay Dale

## Sheet Under Legs.SchDoc: =DocumentName
size A4; Organization: Queen's Formula SAE; Address1: 130 Stuart St, Kingston; Address2: Ontario; Address3: Canada; Address4: K7L 2V9; DocumentNumber: 1; Revision: 0; SheetNumber: 1; SheetTotal: 1
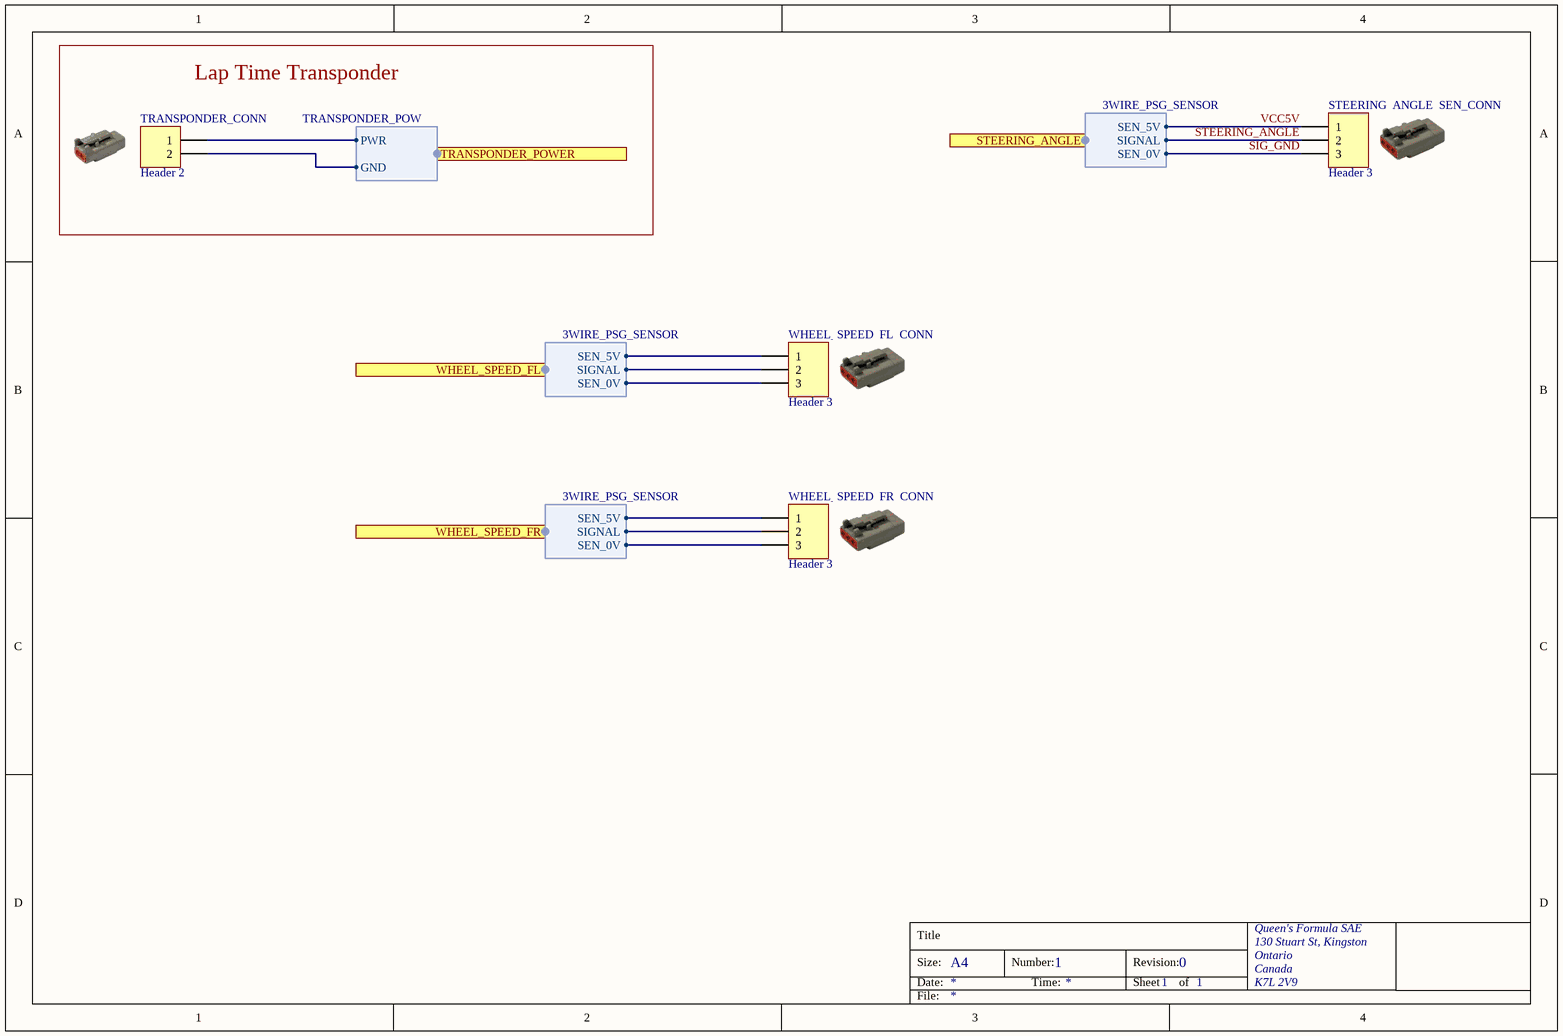
[diagram p3: Under Legs.SchDoc]

### Parts
STEERING_ANGLE_SEN_CONN  Header 3  [HDR1X3]
TRANSPONDER_CONN  Header 2  [HDR1X2]
WHEEL_SPEED_FL_CONN  Header 3  [HDR1X3]
WHEEL_SPEED_FR_CONN  Header 3  [HDR1X3]

### Blocks framed on the sheet
Lap Time Transponder: TRANSPONDER_CONN

### Ports
STEERING_ANGLE (harness 3WIRE_PSG_SENSOR), TRANSPONDER_POWER (harness TRANSPONDER_POW), WHEEL_SPEED_FL (harness 3WIRE_PSG_SENSOR), WHEEL_SPEED_FR (harness 3WIRE_PSG_SENSOR)

### Harnesses
3WIRE_PSG_SENSOR: SEN_5V, SEN_0V, SIGNAL
TRANSPONDER_POW: PWR, GND

### Nets
SIG_GND: STEERING_ANGLE_SEN_CONN.3 TRANSPONDER_CONN.2 WHEEL_SPEED_FL_CONN.3 WHEEL_SPEED_FR_CONN.3 ; port WHEEL_SPEED_FL.SEN_0V, port WHEEL_SPEED_FR.SEN_0V, port TRANSPONDER_POWER.GND, port STEERING_ANGLE.SEN_0V  [project net FUEL_PRESSURE.SEN_0V]
VCC5V: STEERING_ANGLE_SEN_CONN.1 WHEEL_SPEED_FL_CONN.1 WHEEL_SPEED_FR_CONN.1 ; port WHEEL_SPEED_FL.SEN_5V, port WHEEL_SPEED_FR.SEN_5V, port STEERING_ANGLE.SEN_5V  [project net FUEL_PRESSURE.SEN_5V]
STEERING_ANGLE: STEERING_ANGLE_SEN_CONN.2 ; port STEERING_ANGLE.SIGNAL
TRANSPONDER_POWER: TRANSPONDER_CONN.1 ; port TRANSPONDER_POWER.PWR
WHEEL_SPEED_FL: WHEEL_SPEED_FL_CONN.2 ; port WHEEL_SPEED_FL.SIGNAL
WHEEL_SPEED_FR: WHEEL_SPEED_FR_CONN.2 ; port WHEEL_SPEED_FR.SIGNAL

### Notes on the sheet
- Title
- Size:
- Date:
- A4
- Number:
- Time:
- Revision:
- Sheet
- of
- File:

### Library data of the parts
STEERING_ANGLE_SEN_CONN WHEEL_SPEED_FL_CONN WHEEL_SPEED_FR_CONN = Header 3: Header, 3-Pin; LatestRevisionDate: 17-Jul-2002; LatestRevisionNote: Re-released for DXP Platform.; Publisher: Altium Limited
TRANSPONDER_CONN = Header 2: Header, 2-Pin; LatestRevisionDate: 17-Jul-2002; LatestRevisionNote: Re-released for DXP Platform.; Publisher: Altium Limited

## Sheet ECU.SchDoc
size 420 x 297 mm
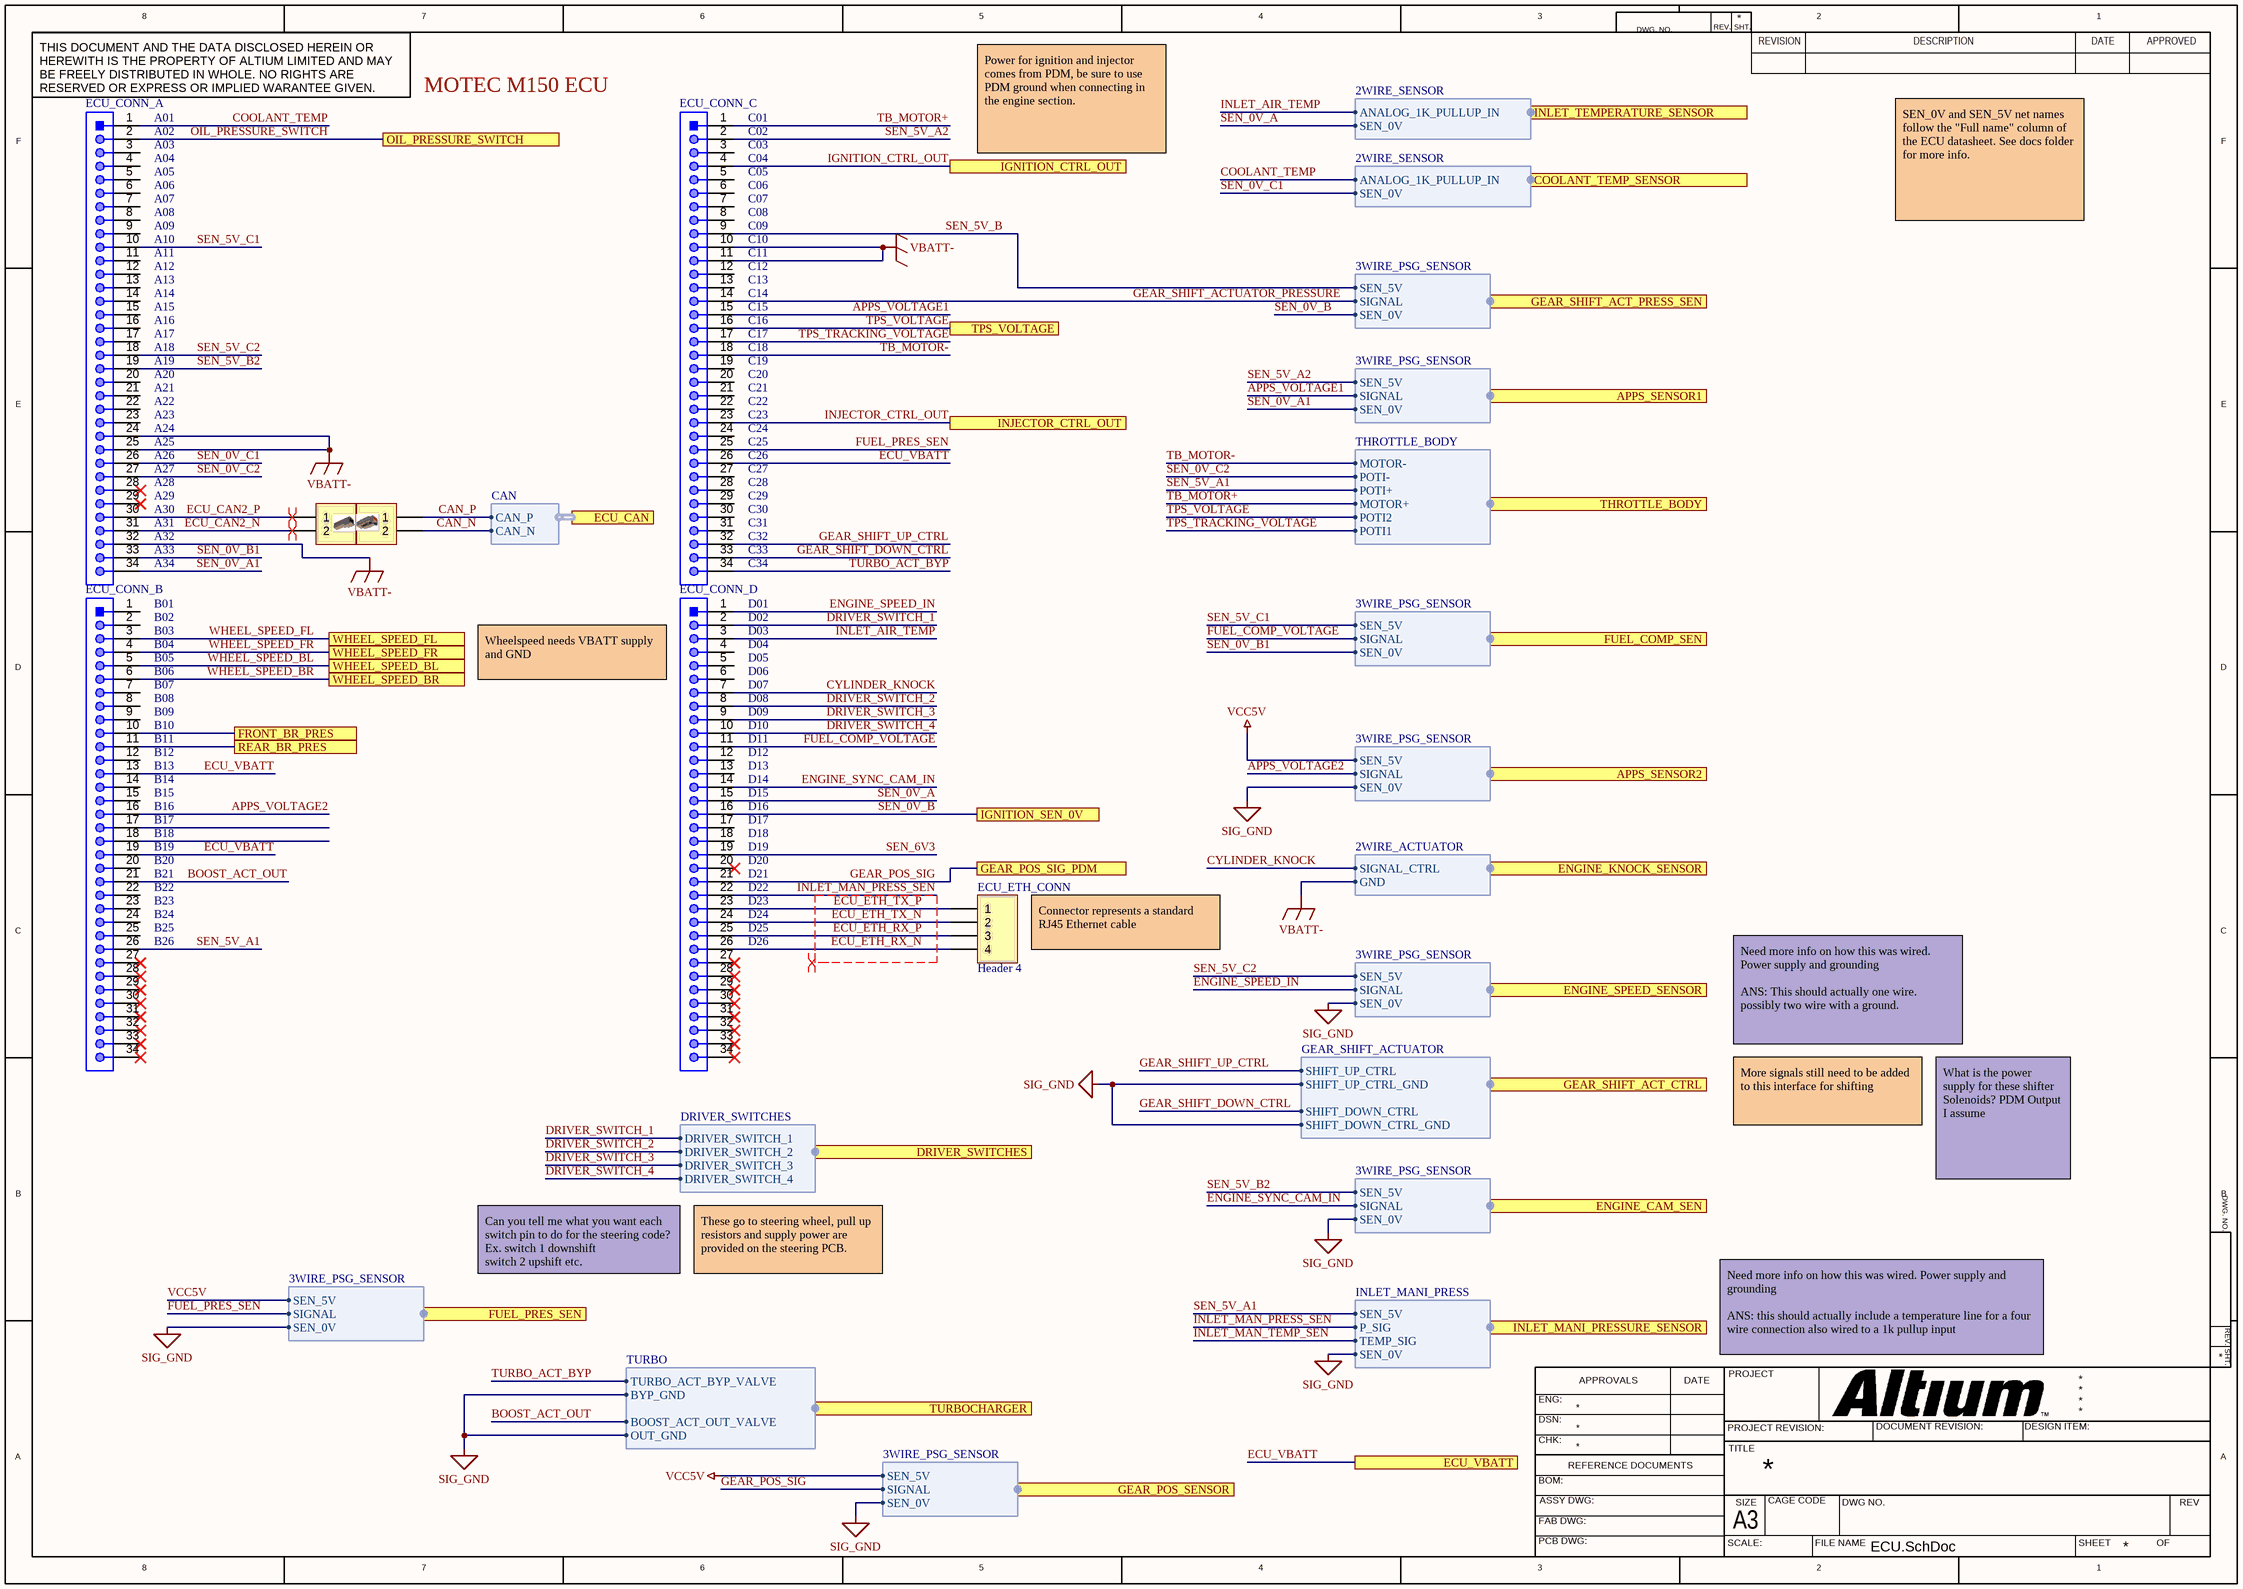
[diagram p4: ECU.SchDoc]

### Parts
(Parts that share a designator on the sheet are numbered #1, #2 ... from top to bottom, then left to right.)
ECU_CAN_CONNECTOR  Header 2  [HDR1X2]  (value not drawn)
ECU_CAN_CONNECTOR?#3  Header 2  [HDR1X2]  (value not drawn)
ECU_CONN_A  61303411021  [61303411021]  (value not drawn)
ECU_CONN_B  61303411021  [61303411021]  (value not drawn)
ECU_CONN_C  61303411021  [61303411021]  (value not drawn)
ECU_CONN_D  61303411021  [61303411021]  (value not drawn)
ECU_ETH_CONN  Header 4  [HDR1X4]

### Ports
APPS_SENSOR1 (harness 3WIRE_PSG_SENSOR), APPS_SENSOR2 (harness 3WIRE_PSG_SENSOR), COOLANT_TEMP_SENSOR (harness 2WIRE_SENSOR), DRIVER_SWITCHES (harness DRIVER_SWITCHES), ECU_CAN (harness CAN), ECU_VBATT, ENGINE_CAM_SEN (harness 3WIRE_PSG_SENSOR), ENGINE_KNOCK_SENSOR (harness 2WIRE_ACTUATOR), ENGINE_SPEED_SENSOR (harness 3WIRE_PSG_SENSOR), FRONT_BR_PRES, FUEL_COMP_SEN (harness 3WIRE_PSG_SENSOR), FUEL_PRES_SEN (harness 3WIRE_PSG_SENSOR), GEAR_POS_SENSOR (harness 3WIRE_PSG_SENSOR), GEAR_POS_SIG_PDM, GEAR_SHIFT_ACT_CTRL (harness GEAR_SHIFT_ACTUATOR), GEAR_SHIFT_ACT_PRESS_SEN (harness 3WIRE_PSG_SENSOR), IGNITION_CTRL_OUT, IGNITION_SEN_0V, INJECTOR_CTRL_OUT, INLET_MANI_PRESSURE_SENSOR (harness INLET_MANI_PRESS), INLET_TEMPERATURE_SENSOR (harness 2WIRE_SENSOR), OIL_PRESSURE_SWITCH, REAR_BR_PRES, THROTTLE_BODY (harness THROTTLE_BODY), TPS_VOLTAGE, TURBOCHARGER (harness TURBO), WHEEL_SPEED_BL, WHEEL_SPEED_BR, WHEEL_SPEED_FL, WHEEL_SPEED_FR

### Harnesses
CAN: CAN_P, CAN_N
2WIRE_SENSOR: ANALOG_1K_PULLUP_IN, SEN_0V
3WIRE_PSG_SENSOR: SEN_5V, SEN_0V, SIGNAL
2WIRE_ACTUATOR: SIGNAL_CTRL, GND
INLET_MANI_PRESS: SEN_5V, SEN_0V, P_SIG, TEMP_SIG
DRIVER_SWITCHES: DRIVER_SWITCH_1, DRIVER_SWITCH_2, DRIVER_SWITCH_3, DRIVER_SWITCH_4
THROTTLE_BODY: MOTOR+, MOTOR-, POTI1, POTI2, POTI-, POTI+
GEAR_SHIFT_ACTUATOR: SHIFT_UP_CTRL, SHIFT_DOWN_CTRL, SHIFT_UP_CTRL_GND, SHIFT_DOWN_CTRL_GND
TURBO: TURBO_ACT_BYP_VALVE, BOOST_ACT_OUT_VALVE, BYP_GND, OUT_GND

### Nets
SEN_5V_A1: ECU_CONN_B.26 ; port INLET_MANI_PRESSURE_SENSOR.SEN_5V, port THROTTLE_BODY.POTI+, port APPS_SENSOR2.SEN_5V, port GEAR_POS_SENSOR.SEN_5V, port FUEL_PRES_SEN.SEN_5V  [also labelled VCC5V]  [project net FUEL_PRESSURE.SEN_5V]
SIG_GND: ECU_CONN_A.24 ECU_CONN_A.25 ECU_CONN_A.32 ECU_CONN_C.10 ECU_CONN_C.11 ; port ENGINE_KNOCK_SENSOR.GND, port ENGINE_SPEED_SENSOR.SEN_0V, port ENGINE_CAM_SEN.SEN_0V, port INLET_MANI_PRESSURE_SENSOR.SEN_0V, port GEAR_SHIFT_ACT_CTRL.SHIFT_UP_CTRL_GND, port GEAR_SHIFT_ACT_CTRL.SHIFT_DOWN_CTRL_GND, port TURBOCHARGER.BYP_GND, port TURBOCHARGER.OUT_GND, port APPS_SENSOR2.SEN_0V, port GEAR_POS_SENSOR.SEN_0V, port FUEL_PRES_SEN.SEN_0V  [also labelled VBATT-]  [project net FUEL_PRESSURE.SEN_0V]
APPS_VOLTAGE1: ECU_CONN_C.15 ; port APPS_SENSOR1.SIGNAL  [project net APPS1_VOLTAGE]
APPS_VOLTAGE2: ECU_CONN_B.16 ; port APPS_SENSOR2.SIGNAL  [project net APPS2_VOLTAGE]
BOOST_ACT_OUT: ECU_CONN_B.21 ; port TURBOCHARGER.BOOST_ACT_OUT_VALVE
BSPD_BRAKE_SEN: ECU_CONN_B.10 ; port FRONT_BR_PRES
CAN_N: ECU_CAN_CONNECTOR?#3.2 ; port ECU_CAN.CAN_N  [project net CAN.CAN_N]
CAN_P: ECU_CAN_CONNECTOR?#3.1 ; port ECU_CAN.CAN_P  [project net CAN.CAN_P]
COOLANT_TEMP: ECU_CONN_A.1 ; port COOLANT_TEMP_SENSOR.ANALOG_1K_PULLUP_IN
CYLINDER_KNOCK: ECU_CONN_D.7 ; port ENGINE_KNOCK_SENSOR.SIGNAL_CTRL
DRIVER_SWITCH_1: ECU_CONN_D.2 ; port DRIVER_SWITCHES.DRIVER_SWITCH_1
DRIVER_SWITCH_2: ECU_CONN_D.8 ; port DRIVER_SWITCHES.DRIVER_SWITCH_2
DRIVER_SWITCH_3: ECU_CONN_D.9 ; port DRIVER_SWITCHES.DRIVER_SWITCH_3
DRIVER_SWITCH_4: ECU_CONN_D.10 ; port DRIVER_SWITCHES.DRIVER_SWITCH_4
ECU_CAN2_N: ECU_CAN_CONNECTOR.2 ECU_CONN_A.31
ECU_CAN2_P: ECU_CAN_CONNECTOR.1 ECU_CONN_A.30
ECU_ETH_RX_N: ECU_CONN_D.26 ECU_ETH_CONN.4
ECU_ETH_RX_P: ECU_CONN_D.25 ECU_ETH_CONN.3
ECU_ETH_TX_N: ECU_CONN_D.24 ECU_ETH_CONN.2
ECU_ETH_TX_P: ECU_CONN_D.23 ECU_ETH_CONN.1
ECU_VBATT: ECU_CONN_B.13 ECU_CONN_B.19 ECU_CONN_C.26 ; port ECU_VBATT
ENGINE_SPEED_IN: ECU_CONN_D.1 ; port ENGINE_SPEED_SENSOR.SIGNAL
ENGINE_SYNC_CAM_IN: ECU_CONN_D.14 ; port ENGINE_CAM_SEN.SIGNAL
FUEL_COMP_VOLTAGE: ECU_CONN_D.11 ; port FUEL_COMP_SEN.SIGNAL
FUEL_PRES_SEN: ECU_CONN_C.25 ; port FUEL_PRES_SEN.SIGNAL
GEAR_POS_SIG: ECU_CONN_D.21 ; port GEAR_POS_SIG_PDM, port GEAR_POS_SENSOR.SIGNAL
GEAR_SHIFT_ACTUATOR_PRESSURE: ECU_CONN_C.14 ; port GEAR_SHIFT_ACT_PRESS_SEN.SIGNAL
GEAR_SHIFT_DOWN_CTRL: ECU_CONN_C.33 ; port GEAR_SHIFT_ACT_CTRL.SHIFT_DOWN_CTRL
GEAR_SHIFT_UP_CTRL: ECU_CONN_C.32 ; port GEAR_SHIFT_ACT_CTRL.SHIFT_UP_CTRL
IGNITION_CTRL_OUT: ECU_CONN_C.4 ; port IGNITION_CTRL_OUT
INJECTOR_CTRL_OUT: ECU_CONN_C.23 ; port INJECTOR_CTRL_OUT
INLET_AIR_TEMP: ECU_CONN_D.3 ; port INLET_TEMPERATURE_SENSOR.ANALOG_1K_PULLUP_IN
INLET_MAN_PRESS_SEN: ECU_CONN_D.22 ; port INLET_MANI_PRESSURE_SENSOR.P_SIG
INLET_MAN_TEMP_SEN: port INLET_MANI_PRESSURE_SENSOR.TEMP_SIG
OIL_PRESSURE_SWITCH: ECU_CONN_A.2 ; port OIL_PRESSURE_SWITCH
REAR_BR_PRES: ECU_CONN_B.11 ; port REAR_BR_PRES
SEN_0V_A: ECU_CONN_D.15 ; port INLET_TEMPERATURE_SENSOR.SEN_0V
SEN_0V_A1: ECU_CONN_A.34 ; port APPS_SENSOR1.SEN_0V
SEN_0V_B: ECU_CONN_D.16 ; port IGNITION_SEN_0V, port GEAR_SHIFT_ACT_PRESS_SEN.SEN_0V  [project net IGNITION_SEN_0V]
SEN_0V_B1: ECU_CONN_A.33 ; port FUEL_COMP_SEN.SEN_0V
SEN_0V_C1: ECU_CONN_A.26 ; port COOLANT_TEMP_SENSOR.SEN_0V
SEN_0V_C2: ECU_CONN_A.27 ; port THROTTLE_BODY.POTI-
SEN_5V_A2: ECU_CONN_C.2 ; port APPS_SENSOR1.SEN_5V
SEN_5V_B: ECU_CONN_C.9 ; port GEAR_SHIFT_ACT_PRESS_SEN.SEN_5V
SEN_5V_B2: ECU_CONN_A.19 ; port ENGINE_CAM_SEN.SEN_5V
SEN_5V_C1: ECU_CONN_A.10 ; port FUEL_COMP_SEN.SEN_5V
SEN_5V_C2: ECU_CONN_A.18 ; port ENGINE_SPEED_SENSOR.SEN_5V
SEN_6V3: ECU_CONN_D.19
TB_MOTOR+: ECU_CONN_C.1 ; port THROTTLE_BODY.MOTOR+
TB_MOTOR-: ECU_CONN_C.18 ; port THROTTLE_BODY.MOTOR-
TPS_TRACKING_VOLTAGE: ECU_CONN_C.17 ; port THROTTLE_BODY.POTI1
TPS_VOLTAGE: ECU_CONN_C.16 ; port TPS_VOLTAGE, port THROTTLE_BODY.POTI2
TURBO_ACT_BYP: ECU_CONN_C.34 ; port TURBOCHARGER.TURBO_ACT_BYP_VALVE
WHEEL_SPEED_BL: ECU_CONN_B.5 ; port WHEEL_SPEED_BL
WHEEL_SPEED_BR: ECU_CONN_B.6 ; port WHEEL_SPEED_BR
WHEEL_SPEED_FL: ECU_CONN_B.3 ; port WHEEL_SPEED_FL
WHEEL_SPEED_FR: ECU_CONN_B.4 ; port WHEEL_SPEED_FR

Not connected (* = marked no-connect by the designer): ECU_CONN_A 3 4 5 6 7 8 9 11 12 13 14 15 16 17 20 21 22 23 28* 29*; ECU_CONN_B 1 2 7 8 9 12 14 15 17 18 20 22 23 24 25 27* 28* 29* 30* 31* 32* 33* 34*; ECU_CONN_C 3 5 6 7 8 12 13 19 20 21 22 24 27 28 29 30 31; ECU_CONN_D 4 5 6 12 13 17 18 20* 27* 28* 29* 30* 31* 32* 33* 34*

### Layout directives
differential pair: ECU_CAN2_N, ECU_CAN2_P, ECU_ETH_RX_N, ECU_ETH_RX_P, ECU_ETH_TX_N, ECU_ETH_TX_P, INLET_MAN_PRESS_SEN

### Notes on the sheet
- (near ECU_CONN_A) A01
- MOTEC M150 ECU
- (near ECU_CONN_C) C01
- (near ECU_CONN_A) A02
- (near ECU_CONN_A) A03
- (near ECU_CONN_A) A04
- (near ECU_CONN_A) A05
- (near ECU_CONN_A) A06
- (near ECU_CONN_C) C02
- (near ECU_CONN_C) C03
- (near ECU_CONN_C) C04
- (near ECU_CONN_C) C05
- (near ECU_CONN_C) C06
- Power for ignition and injector comes from PDM, be sure to use PDM ground when connecting in the engine section.
- (near ECU_CONN_A) A07
- (near ECU_CONN_A) A08
- (near ECU_CONN_A) A09
- (near ECU_CONN_A) A10
- (near ECU_CONN_A) A11
- (near ECU_CONN_C) C07
- (near ECU_CONN_C) C08
- (near ECU_CONN_C) C09
- (near ECU_CONN_C) C10
- (near ECU_CONN_C) C11
- SEN_0V and SEN_5V net names follow the "Full name" column of the ECU datasheet. See docs folder for more info.
- (near ECU_CONN_A) A12
- (near ECU_CONN_A) A13
- (near ECU_CONN_A) A14
- (near ECU_CONN_A) A15
- (near ECU_CONN_A) A16
- (near ECU_CONN_C) C12
- (near ECU_CONN_C) C13
- (near ECU_CONN_C) C14
- (near ECU_CONN_C) C15
- (near ECU_CONN_C) C16
- (near ECU_CONN_A) A17
- (near ECU_CONN_A) A18
- (near ECU_CONN_A) A19
- (near ECU_CONN_A) A20
- (near ECU_CONN_A) A21
- (near ECU_CONN_C) C17
- (near ECU_CONN_C) C18
- (near ECU_CONN_C) C19
- (near ECU_CONN_C) C20
- (near ECU_CONN_C) C21
- (near ECU_CONN_A) A22
- (near ECU_CONN_A) A23
- (near ECU_CONN_A) A24
- (near ECU_CONN_A) A25
- (near ECU_CONN_A) A26
- (near ECU_CONN_C) C22
- (near ECU_CONN_C) C23
- (near ECU_CONN_C) C24
- (near ECU_CONN_C) C25
- (near ECU_CONN_C) C26
- (near ECU_CONN_A) A27
- (near ECU_CONN_A) A28
- (near ECU_CONN_A) A29
- (near ECU_CONN_A) A30
- (near ECU_CONN_A) A31
- (near ECU_CONN_C) C27
- (near ECU_CONN_C) C28
- (near ECU_CONN_C) C29
- (near ECU_CONN_C) C30
- (near ECU_CONN_C) C31
- (near ECU_CONN_A) A32
- (near ECU_CONN_A) A33
- A34
- (near ECU_CONN_C) C32
- (near ECU_CONN_C) C33
- C34
- B01
- B02
- (near ECU_CONN_B) B03
- (near ECU_CONN_B) B04
- (near ECU_CONN_B) B05
- D01
- D02
- (near ECU_CONN_D) D03
- (near ECU_CONN_D) D04
- (near ECU_CONN_D) D05
- (near ECU_CONN_B) B06
- (near ECU_CONN_B) B07
- (near ECU_CONN_B) B08
- (near ECU_CONN_B) B09
- (near ECU_CONN_B) B10
- (near ECU_CONN_D) Wheelspeed needs VBATT supply and GND
- (near ECU_CONN_D) D06
- (near ECU_CONN_D) D07
- (near ECU_CONN_D) D08
- (near ECU_CONN_D) D09
- (near ECU_CONN_D) D10
- (near ECU_CONN_B) B11
- (near ECU_CONN_B) B12
- (near ECU_CONN_B) B13
- (near ECU_CONN_B) B14
- (near ECU_CONN_B) B15
- (near ECU_CONN_D) D11
- (near ECU_CONN_D) D12
- (near ECU_CONN_D) D13
- (near ECU_CONN_D) D14
- (near ECU_CONN_D) D15
- (near ECU_CONN_B) B16
- (near ECU_CONN_B) B17
- (near ECU_CONN_B) B18
- (near ECU_CONN_B) B19
- (near ECU_CONN_B) B20
- (near ECU_CONN_D) D16
- (near ECU_CONN_D) D17
- (near ECU_CONN_D) D18
- (near ECU_CONN_D) D19
- (near ECU_CONN_D) D20
- (near ECU_CONN_B) B21
- (near ECU_CONN_B) B22
- (near ECU_CONN_B) B23
- (near ECU_CONN_B) B24
- (near ECU_CONN_B) B25
- (near ECU_CONN_D) D21
- (near ECU_CONN_D) D22
- (near ECU_CONN_D) D23
- (near ECU_CONN_D) D24
- (near ECU_CONN_D) D25
- (near ECU_CONN_B) B26
- (near ECU_CONN_D) D26
- Connector represents a standard RJ45 Ethernet cable
- Need more info on how this was wired. Power supply and grounding
  ANS: This should actually one wire. possibly two wire with a ground.
- More signals still need to be added to this interface for shifting
- What is the power supply for these shifter Solenoids? PDM Output I assume
- Can you tell me what you want each switch pin to do for the steering code? Ex. switch 1 downshift
  switch 2 upshift etc.
- These go to steering wheel, pull up resistors and supply power are provided on the steering PCB.
- Need more info on how this was wired. Power supply and grounding
  ANS: this should actually include a temperature line for a four wire connection also wired to a 1k pullup input
- 8
- 7
- 6
- 5
- 4
- 3
- DWG. NO.
- REV.
- SHT.
- REVISION
- 2
- DESCRIPTION
- DATE
- 1
- APPROVED
- THIS DOCUMENT AND THE DATA DISCLOSED HEREIN OR HEREWITH IS THE PROPERTY OF ALTIUM LIMITED AND MAY BE FREELY DISTRIBUTED IN WHOLE. NO RIGHTS ARE RESERVED OR EXPRESS OR IMPLIED WARANTEE GIVEN.
- F
- E
- D
- C
- B
- ENG:
- APPROVALS
- PROJECT
- A
- DSN:
- CHK:
- REFERENCE DOCUMENTS
- PROJECT REVISION:
- TITLE
- DOCUMENT REVISION:
- DESIGN ITEM:
- BOM:
- FAB DWG:
- PCB DWG:
- ASSY DWG:
- SCALE:
- A3
- SIZE
- CAGE CODE
- FILE NAME
- DWG NO.
- SHEET
- OF
- REV

### Library data of the parts
ECU_CAN_CONNECTOR ECU_CAN_CONNECTOR?#3 = Header 2: Header, 2-Pin; LatestRevisionDate: 17-Jul-2002; LatestRevisionNote: Re-released for DXP Platform.; Publisher: Altium Limited
ECU_CONN_A ECU_CONN_B ECU_CONN_C ECU_CONN_D = CMP-1502-01125-1: THT Angled Pin Header WR-PHD, Pitch 2.54 mm, Single Row, 34 pins; Manufacturer: Wurth Elektronik; Withstanding Voltage: 500VAC; Pin Number: 34; Rated Current: 3A; Gender: Male; Pitch: 2.54mm; Working Voltage: 250VAC; Contact Resistance: 20mOhm; Orientation: Angled; Mounting Technology: THT; Package Reference: 61303411021; Part Number: 61303411021; Datasheet URL: https://katalog.we-online.de/em/datasheet/6130xx11021.pdf; Publisher: WurthElektronik; Row Number: Single; Operating Temperature: -40to105degC; Packaging: Bag; Manufacturer URL: http://www.we-online.de
ECU_ETH_CONN = Header 4: Header, 4-Pin; LatestRevisionDate: 17-Jul-2002; LatestRevisionNote: Re-released for DXP Platform.; Publisher: Altium Limited

## Sheet Engine Bay and Rear Tube.SchDoc: =DocumentName
size 420 x 297 mm; Organization: Queen's Formula SAE; Address1: 130 Stuart St, Kingston; Address2: Ontario; Address3: Canada; Address4: K7L 2V9; DocumentNumber: 1; Revision: 0; SheetNumber: 1; SheetTotal: 1
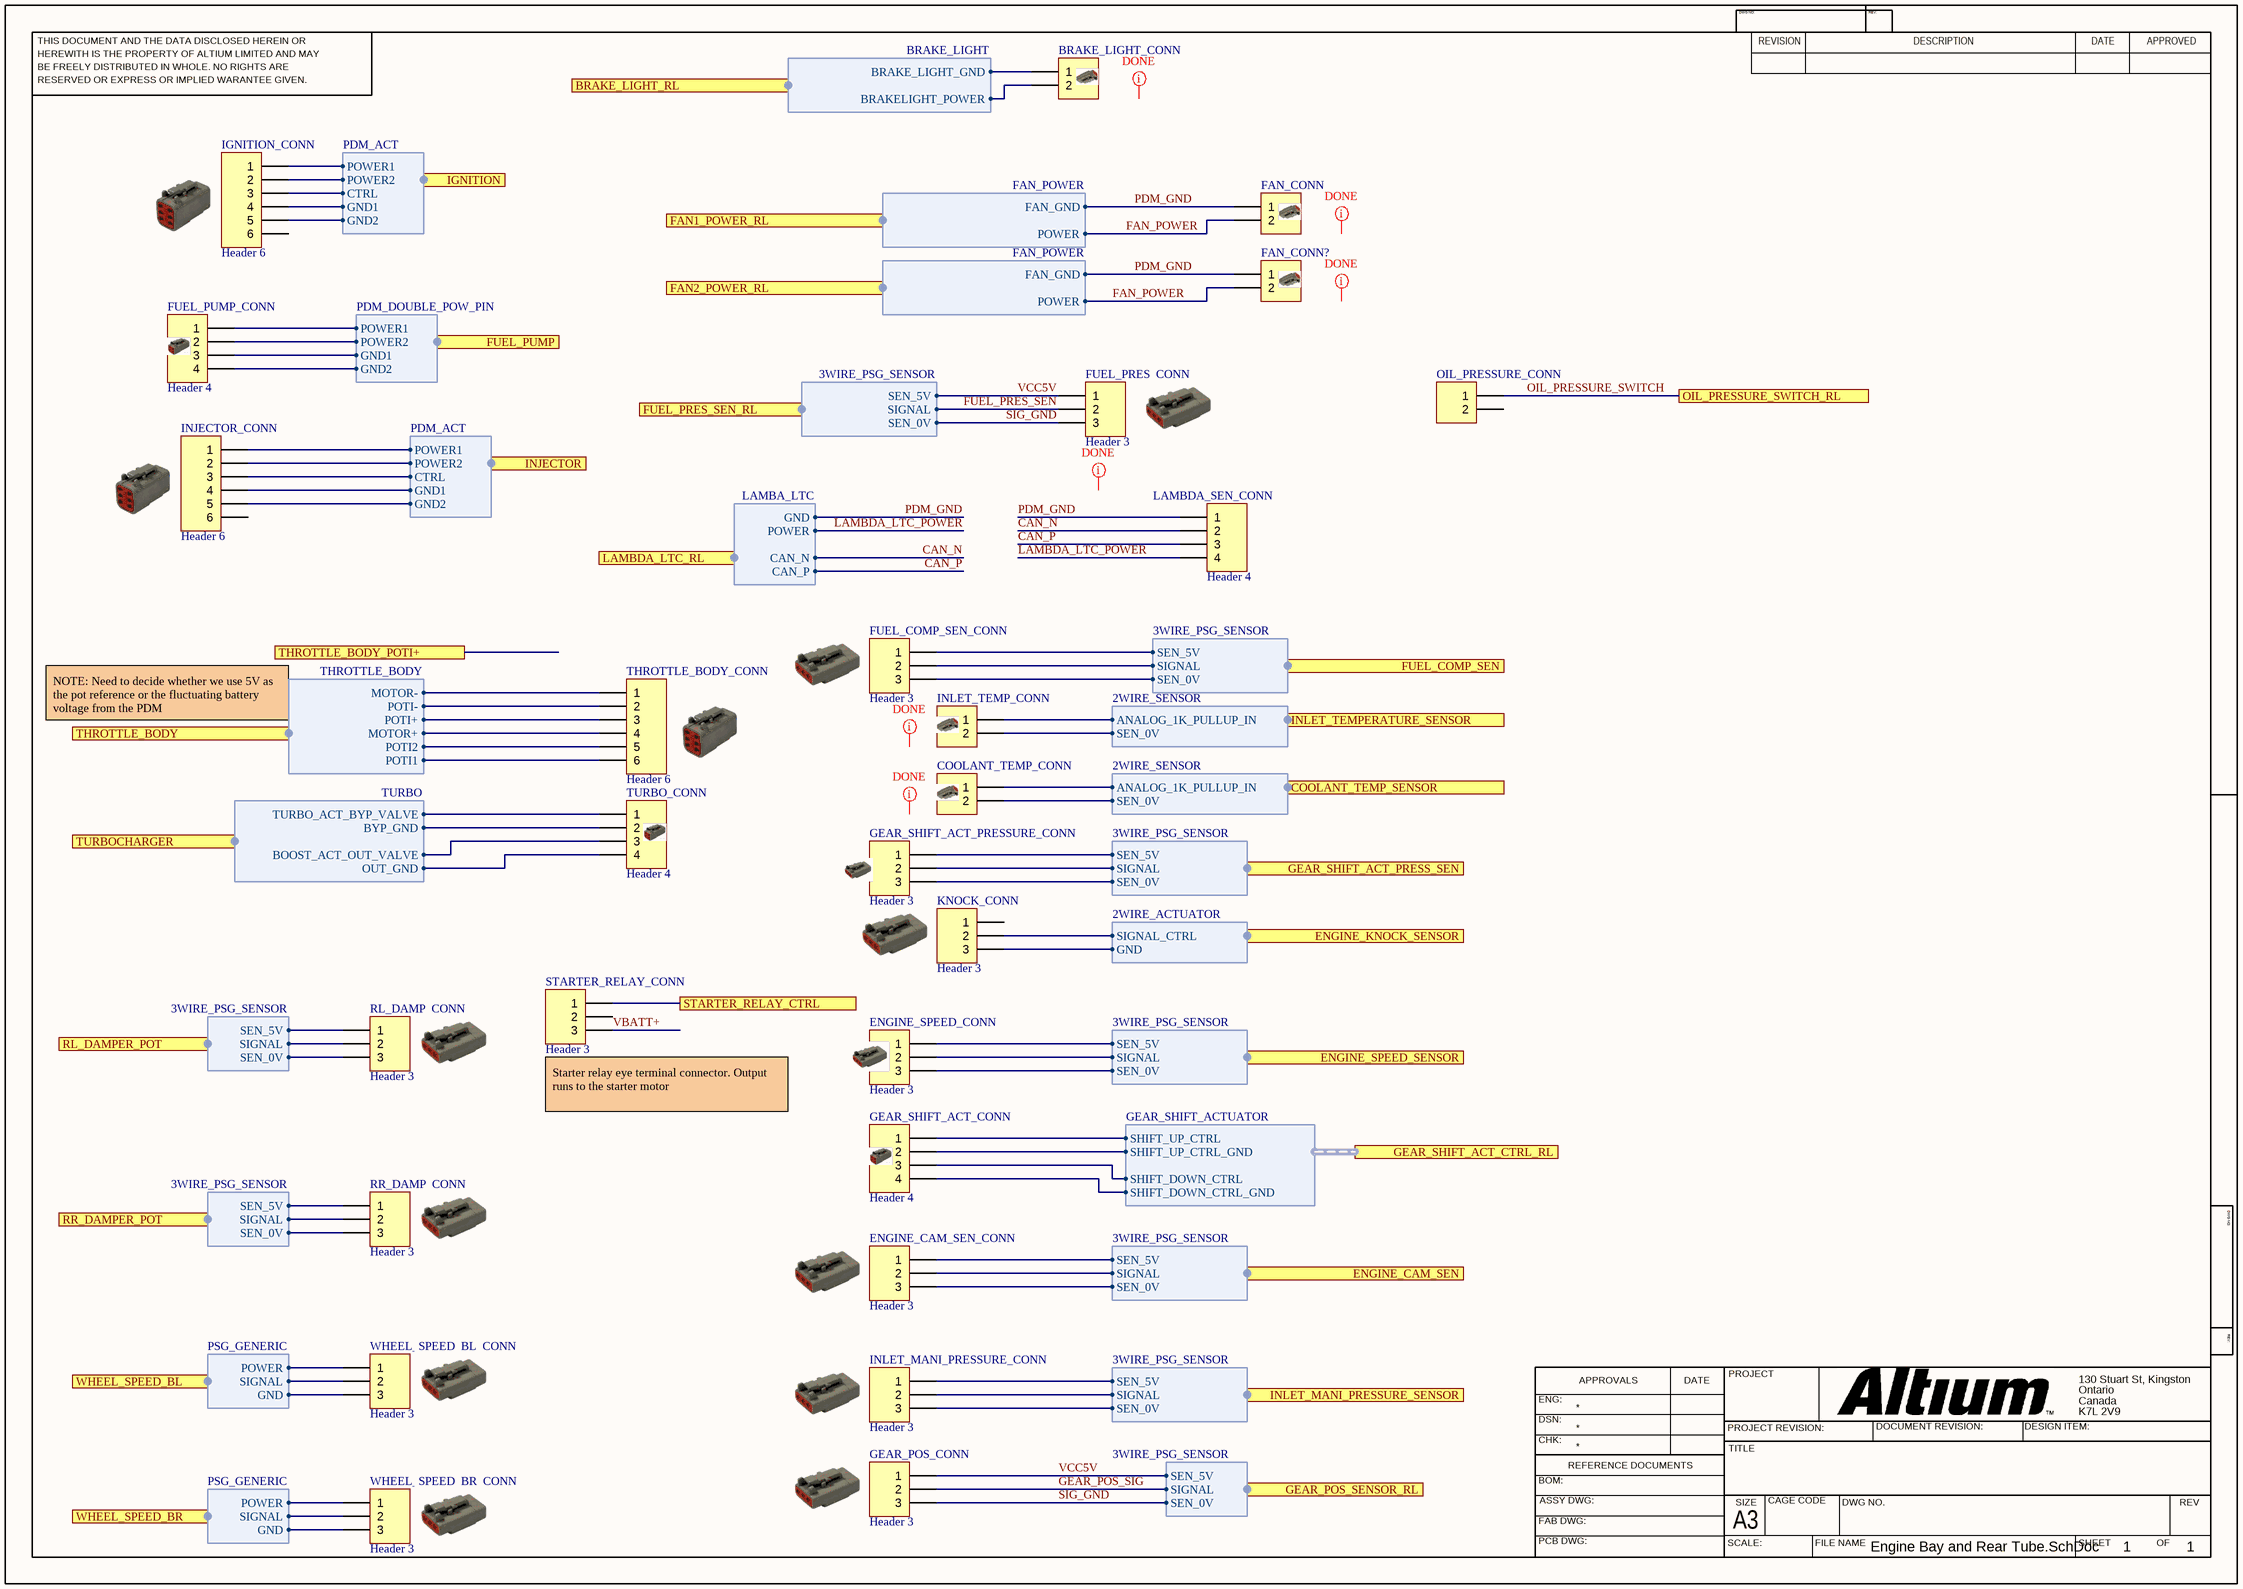
[diagram p5: Engine Bay and Rear Tube.SchDoc]

### Parts
BRAKE_LIGHT_CONN  Header 2  [HDR1X2]  (value not drawn)
COOLANT_TEMP_CONN  Header 2  [HDR1X2]  (value not drawn)
ENGINE_CAM_SEN_CONN  Header 3  [HDR1X3]
ENGINE_SPEED_CONN  Header 3  [HDR1X3]
FAN_CONN  Header 2  [HDR1X2]  (value not drawn)
FAN_CONN?  Header 2  [HDR1X2]  (value not drawn)
FUEL_COMP_SEN_CONN  Header 3  [HDR1X3]
FUEL_PRES_CONN  Header 3  [HDR1X3]
FUEL_PUMP_CONN  Header 4  [HDR1X4]
GEAR_POS_CONN  Header 3  [HDR1X3]
GEAR_SHIFT_ACT_CONN  Header 4  [HDR1X4]
GEAR_SHIFT_ACT_PRESSURE_CONN  Header 3  [HDR1X3]
IGNITION_CONN  Header 6  [HDR1X6]
INJECTOR_CONN  Header 6  [HDR1X6]
INLET_MANI_PRESSURE_CONN  Header 3  [HDR1X3]
INLET_TEMP_CONN  Header 2  [HDR1X2]  (value not drawn)
KNOCK_CONN  Header 3  [HDR1X3]
LAMBDA_SEN_CONN  Header 4  [HDR1X4]
OIL_PRESSURE_CONN  Header 2  [HDR1X2]  (value not drawn)
RL_DAMP_CONN  Header 3  [HDR1X3]
RR_DAMP_CONN  Header 3  [HDR1X3]
STARTER_RELAY_CONN  Header 3  [HDR1X3]
THROTTLE_BODY_CONN  Header 6  [HDR1X6]
TURBO_CONN  Header 4  [HDR1X4]
WHEEL_SPEED_BL_CONN  Header 3  [HDR1X3]
WHEEL_SPEED_BR_CONN  Header 3  [HDR1X3]

### Ports
BRAKE_LIGHT_RL (harness BRAKE_LIGHT), COOLANT_TEMP_SENSOR (harness 2WIRE_SENSOR), ENGINE_CAM_SEN (harness 3WIRE_PSG_SENSOR), ENGINE_KNOCK_SENSOR (harness 2WIRE_ACTUATOR), ENGINE_SPEED_SENSOR (harness 3WIRE_PSG_SENSOR), FAN1_POWER_RL (harness FAN_POWER), FAN2_POWER_RL (harness FAN_POWER), FUEL_COMP_SEN (harness 3WIRE_PSG_SENSOR), FUEL_PRES_SEN_RL (harness 3WIRE_PSG_SENSOR), FUEL_PUMP (harness PDM_DOUBLE_POW_PIN), GEAR_POS_SENSOR_RL (harness 3WIRE_PSG_SENSOR), GEAR_SHIFT_ACT_CTRL_RL (harness GEAR_SHIFT_ACTUATOR), GEAR_SHIFT_ACT_PRESS_SEN (harness 3WIRE_PSG_SENSOR), IGNITION (harness PDM_ACT), INJECTOR (harness PDM_ACT), INLET_MANI_PRESSURE_SENSOR (harness 3WIRE_PSG_SENSOR), INLET_TEMPERATURE_SENSOR (harness 2WIRE_SENSOR), LAMBDA_LTC_RL (harness LAMBA_LTC), OIL_PRESSURE_SWITCH_RL, RL_DAMPER_POT (harness 3WIRE_PSG_SENSOR), RR_DAMPER_POT (harness 3WIRE_PSG_SENSOR), STARTER_RELAY_CTRL, THROTTLE_BODY (harness THROTTLE_BODY), THROTTLE_BODY_POTI+, TURBOCHARGER (harness TURBO), WHEEL_SPEED_BL (harness PSG_GENERIC), WHEEL_SPEED_BR (harness PSG_GENERIC)

### Harnesses
2WIRE_SENSOR: ANALOG_1K_PULLUP_IN, SEN_0V
3WIRE_PSG_SENSOR: SEN_5V, SEN_0V, SIGNAL
2WIRE_ACTUATOR: SIGNAL_CTRL, GND
THROTTLE_BODY: MOTOR+, MOTOR-, POTI1, POTI2, POTI-, POTI+
GEAR_SHIFT_ACTUATOR: SHIFT_UP_CTRL, SHIFT_DOWN_CTRL, SHIFT_UP_CTRL_GND, SHIFT_DOWN_CTRL_GND
PDM_ACT: POWER1, CTRL, GND1, GND2, POWER2
TURBO: TURBO_ACT_BYP_VALVE, BOOST_ACT_OUT_VALVE, BYP_GND, OUT_GND
PDM_DOUBLE_POW_PIN: POWER1, GND1, GND2, POWER2
BRAKE_LIGHT: BRAKELIGHT_POWER, BRAKE_LIGHT_GND
PSG_GENERIC: POWER, GND, SIGNAL
FAN_POWER: POWER, FAN_GND
LAMBA_LTC: CAN_P, CAN_N, POWER, GND

### Nets
SIG_GND: ENGINE_CAM_SEN_CONN.3 ENGINE_SPEED_CONN.3 FUEL_PRES_CONN.3 GEAR_POS_CONN.3 GEAR_SHIFT_ACT_CONN.2 GEAR_SHIFT_ACT_CONN.4 INLET_MANI_PRESSURE_CONN.3 KNOCK_CONN.3 RL_DAMP_CONN.3 RR_DAMP_CONN.3 TURBO_CONN.2 TURBO_CONN.4 WHEEL_SPEED_BL_CONN.3 WHEEL_SPEED_BR_CONN.3 ; port ENGINE_KNOCK_SENSOR.GND, port ENGINE_SPEED_SENSOR.SEN_0V, port ENGINE_CAM_SEN.SEN_0V, port INLET_MANI_PRESSURE_SENSOR.SEN_0V, port GEAR_SHIFT_ACT_CTRL_RL.SHIFT_UP_CTRL_GND, port GEAR_SHIFT_ACT_CTRL_RL.SHIFT_DOWN_CTRL_GND, port TURBOCHARGER.BYP_GND, port TURBOCHARGER.OUT_GND, port RL_DAMPER_POT.SEN_0V, port RR_DAMPER_POT.SEN_0V, port WHEEL_SPEED_BL.GND, port WHEEL_SPEED_BR.GND, port GEAR_POS_SENSOR_RL.SEN_0V, port FUEL_PRES_SEN_RL.SEN_0V  [project net FUEL_PRESSURE.SEN_0V]
VCC5V: FUEL_PRES_CONN.1 GEAR_POS_CONN.1 INLET_MANI_PRESSURE_CONN.1 RL_DAMP_CONN.1 RR_DAMP_CONN.1 THROTTLE_BODY_CONN.3 ; port THROTTLE_BODY.POTI+, port INLET_MANI_PRESSURE_SENSOR.SEN_5V, port RL_DAMPER_POT.SEN_5V, port RR_DAMPER_POT.SEN_5V, port GEAR_POS_SENSOR_RL.SEN_5V, port FUEL_PRES_SEN_RL.SEN_5V  [project net FUEL_PRESSURE.SEN_5V]
BOOST_ACT_OUT: TURBO_CONN.3 ; port TURBOCHARGER.BOOST_ACT_OUT_VALVE
BRAKE_LIGHT: BRAKE_LIGHT_CONN.2 ; port BRAKE_LIGHT_RL.BRAKELIGHT_POWER
CAN_N: LAMBDA_SEN_CONN.2 ; port LAMBDA_LTC_RL.CAN_N  [project net CAN.CAN_N]
CAN_P: LAMBDA_SEN_CONN.3 ; port LAMBDA_LTC_RL.CAN_P  [project net CAN.CAN_P]
COOLANT_TEMP: COOLANT_TEMP_CONN.1 ; port COOLANT_TEMP_SENSOR.ANALOG_1K_PULLUP_IN
CYLINDER_KNOCK: KNOCK_CONN.2 ; port ENGINE_KNOCK_SENSOR.SIGNAL_CTRL
ENGINE_SPEED_IN: ENGINE_SPEED_CONN.2 ; port ENGINE_SPEED_SENSOR.SIGNAL
ENGINE_SYNC_CAM_IN: ENGINE_CAM_SEN_CONN.2 ; port ENGINE_CAM_SEN.SIGNAL
FAN_POWER: FAN_CONN.2 FAN_CONN?.2 ; port FAN1_POWER_RL.POWER, port FAN2_POWER_RL.POWER  [project net COOLING_FAN_POWER]
FUEL_COMP_VOLTAGE: FUEL_COMP_SEN_CONN.2 ; port FUEL_COMP_SEN.SIGNAL
FUEL_INJECTOR_POWER: INJECTOR_CONN.1 INJECTOR_CONN.2 ; port INJECTOR.POWER1, port INJECTOR.POWER2
FUEL_PRES_SEN: FUEL_PRES_CONN.2 ; port FUEL_PRES_SEN_RL.SIGNAL
FUEL_PUMP_POWER: FUEL_PUMP_CONN.1 FUEL_PUMP_CONN.2 ; port FUEL_PUMP.POWER1, port FUEL_PUMP.POWER2
GEAR_POS_SIG: GEAR_POS_CONN.2 ; port GEAR_POS_SENSOR_RL.SIGNAL
GEAR_SHIFT_ACTUATOR_PRESSURE: GEAR_SHIFT_ACT_PRESSURE_CONN.2 ; port GEAR_SHIFT_ACT_PRESS_SEN.SIGNAL
GEAR_SHIFT_DOWN_CTRL: GEAR_SHIFT_ACT_CONN.3 ; port GEAR_SHIFT_ACT_CTRL_RL.SHIFT_DOWN_CTRL
GEAR_SHIFT_UP_CTRL: GEAR_SHIFT_ACT_CONN.1 ; port GEAR_SHIFT_ACT_CTRL_RL.SHIFT_UP_CTRL
IGNITION_COIL_POWER: IGNITION_CONN.1 IGNITION_CONN.2 ; port IGNITION.POWER1, port IGNITION.POWER2
IGNITION_CTRL_OUT: IGNITION_CONN.3 ; port IGNITION.CTRL
IGNITION_SEN_0V: GEAR_SHIFT_ACT_PRESSURE_CONN.3 IGNITION_CONN.5 ; port GEAR_SHIFT_ACT_PRESS_SEN.SEN_0V, port IGNITION.GND2
INJECTOR_CTRL_OUT: INJECTOR_CONN.3 ; port INJECTOR.CTRL
INLET_AIR_TEMP: INLET_TEMP_CONN.1 ; port INLET_TEMPERATURE_SENSOR.ANALOG_1K_PULLUP_IN
INLET_MAN_PRESS_SEN: INLET_MANI_PRESSURE_CONN.2 ; port INLET_MANI_PRESSURE_SENSOR.SIGNAL
LAMBDA_LTC_POWER: LAMBDA_SEN_CONN.4 ; port LAMBDA_LTC_RL.POWER
OIL_PRESSURE_SWITCH: OIL_PRESSURE_CONN.1 ; port OIL_PRESSURE_SWITCH_RL
PDM_GND: BRAKE_LIGHT_CONN.1 FAN_CONN.1 FAN_CONN?.1 FUEL_PUMP_CONN.3 FUEL_PUMP_CONN.4 IGNITION_CONN.4 INJECTOR_CONN.4 INJECTOR_CONN.5 LAMBDA_SEN_CONN.1 ; port IGNITION.GND1, port FUEL_PUMP.GND1, port FUEL_PUMP.GND2, port INJECTOR.GND1, port INJECTOR.GND2, port BRAKE_LIGHT_RL.BRAKE_LIGHT_GND, port FAN1_POWER_RL.FAN_GND, port FAN2_POWER_RL.FAN_GND, port LAMBDA_LTC_RL.GND
RL_DAMPER_POT: RL_DAMP_CONN.2 ; port RL_DAMPER_POT.SIGNAL
RR_DAMPER_POT: RR_DAMP_CONN.2 ; port RR_DAMPER_POT.SIGNAL
SEN_0V_A: INLET_TEMP_CONN.2 ; port INLET_TEMPERATURE_SENSOR.SEN_0V
SEN_0V_B1: FUEL_COMP_SEN_CONN.3 ; port FUEL_COMP_SEN.SEN_0V
SEN_0V_C1: COOLANT_TEMP_CONN.2 ; port COOLANT_TEMP_SENSOR.SEN_0V
SEN_0V_C2: THROTTLE_BODY_CONN.2 ; port THROTTLE_BODY.POTI-
SEN_5V_B: GEAR_SHIFT_ACT_PRESSURE_CONN.1 ; port GEAR_SHIFT_ACT_PRESS_SEN.SEN_5V
SEN_5V_B2: ENGINE_CAM_SEN_CONN.1 ; port ENGINE_CAM_SEN.SEN_5V
SEN_5V_C1: FUEL_COMP_SEN_CONN.1 ; port FUEL_COMP_SEN.SEN_5V
SEN_5V_C2: ENGINE_SPEED_CONN.1 ; port ENGINE_SPEED_SENSOR.SEN_5V
STARTER_RELAY_CTRL: STARTER_RELAY_CONN.1 ; port STARTER_RELAY_CTRL
TB_MOTOR+: THROTTLE_BODY_CONN.4 ; port THROTTLE_BODY.MOTOR+
TB_MOTOR-: THROTTLE_BODY_CONN.1 ; port THROTTLE_BODY.MOTOR-
TPS_TRACKING_VOLTAGE: THROTTLE_BODY_CONN.6 ; port THROTTLE_BODY.POTI1
TPS_VOLTAGE: THROTTLE_BODY_CONN.5 ; port THROTTLE_BODY.POTI2
TURBO_ACT_BYP: TURBO_CONN.1 ; port TURBOCHARGER.TURBO_ACT_BYP_VALVE
VBATT: WHEEL_SPEED_BL_CONN.1 WHEEL_SPEED_BR_CONN.1 ; port WHEEL_SPEED_BL.POWER, port WHEEL_SPEED_BR.POWER
VBATT+: STARTER_RELAY_CONN.3
WHEEL_SPEED_BL: WHEEL_SPEED_BL_CONN.2 ; port WHEEL_SPEED_BL.SIGNAL
WHEEL_SPEED_BR: WHEEL_SPEED_BR_CONN.2 ; port WHEEL_SPEED_BR.SIGNAL

Not connected (* = marked no-connect by the designer): IGNITION_CONN 6; INJECTOR_CONN 6; KNOCK_CONN 1; OIL_PRESSURE_CONN 2; STARTER_RELAY_CONN 2

### Layout directives
mark named DONE: (no net found under the mark)

### Notes on the sheet
- NOTE: Need to decide whether we use 5V as the pot reference or the fluctuating battery voltage from the PDM
- (near STARTER_RELAY_CONN) Starter relay eye terminal connector. Output runs to the starter motor
- THIS DOCUMENT AND THE DATA DISCLOSED HEREIN OR
- HEREWITH IS THE PROPERTY OF ALTIUM LIMITED AND MAY
- DWG NO:
- REVISION
- REV:
- DESCRIPTION
- DATE
- APPROVED
- BE FREELY DISTRIBUTED IN WHOLE. NO RIGHTS ARE
- RESERVED OR EXPRESS OR IMPLIED WARANTEE GIVEN.
- ENG:
- APPROVALS
- PROJECT
- DSN:
- CHK:
- REFERENCE DOCUMENTS
- PROJECT REVISION:
- TITLE
- DOCUMENT REVISION:
- DESIGN ITEM:
- BOM:
- FAB DWG:
- PCB DWG:
- ASSY DWG:
- SCALE:
- A3
- SIZE
- CAGE CODE
- FILE NAME
- DWG NO.
- SHEET
- OF
- REV

### Library data of the parts
BRAKE_LIGHT_CONN COOLANT_TEMP_CONN FAN_CONN FAN_CONN? INLET_TEMP_CONN OIL_PRESSURE_CONN = Header 2: Header, 2-Pin; LatestRevisionDate: 17-Jul-2002; LatestRevisionNote: Re-released for DXP Platform.; Publisher: Altium Limited
ENGINE_CAM_SEN_CONN ENGINE_SPEED_CONN FUEL_COMP_SEN_CONN FUEL_PRES_CONN GEAR_POS_CONN GEAR_SHIFT_ACT_PRESSURE_CONN INLET_MANI_PRESSURE_CONN KNOCK_CONN RL_DAMP_CONN RR_DAMP_CONN STARTER_RELAY_CONN WHEEL_SPEED_BL_CONN WHEEL_SPEED_BR_CONN = Header 3: Header, 3-Pin; LatestRevisionDate: 17-Jul-2002; LatestRevisionNote: Re-released for DXP Platform.; Publisher: Altium Limited
FUEL_PUMP_CONN GEAR_SHIFT_ACT_CONN LAMBDA_SEN_CONN TURBO_CONN = Header 4: Header, 4-Pin; LatestRevisionDate: 17-Jul-2002; LatestRevisionNote: Re-released for DXP Platform.; Publisher: Altium Limited
IGNITION_CONN INJECTOR_CONN THROTTLE_BODY_CONN = Header 6: Header, 6-Pin; LatestRevisionDate: 17-Jul-2002; LatestRevisionNote: Re-released for DXP Platform.; Publisher: Altium Limited